# Altium project LUNA 2.PrjPcb
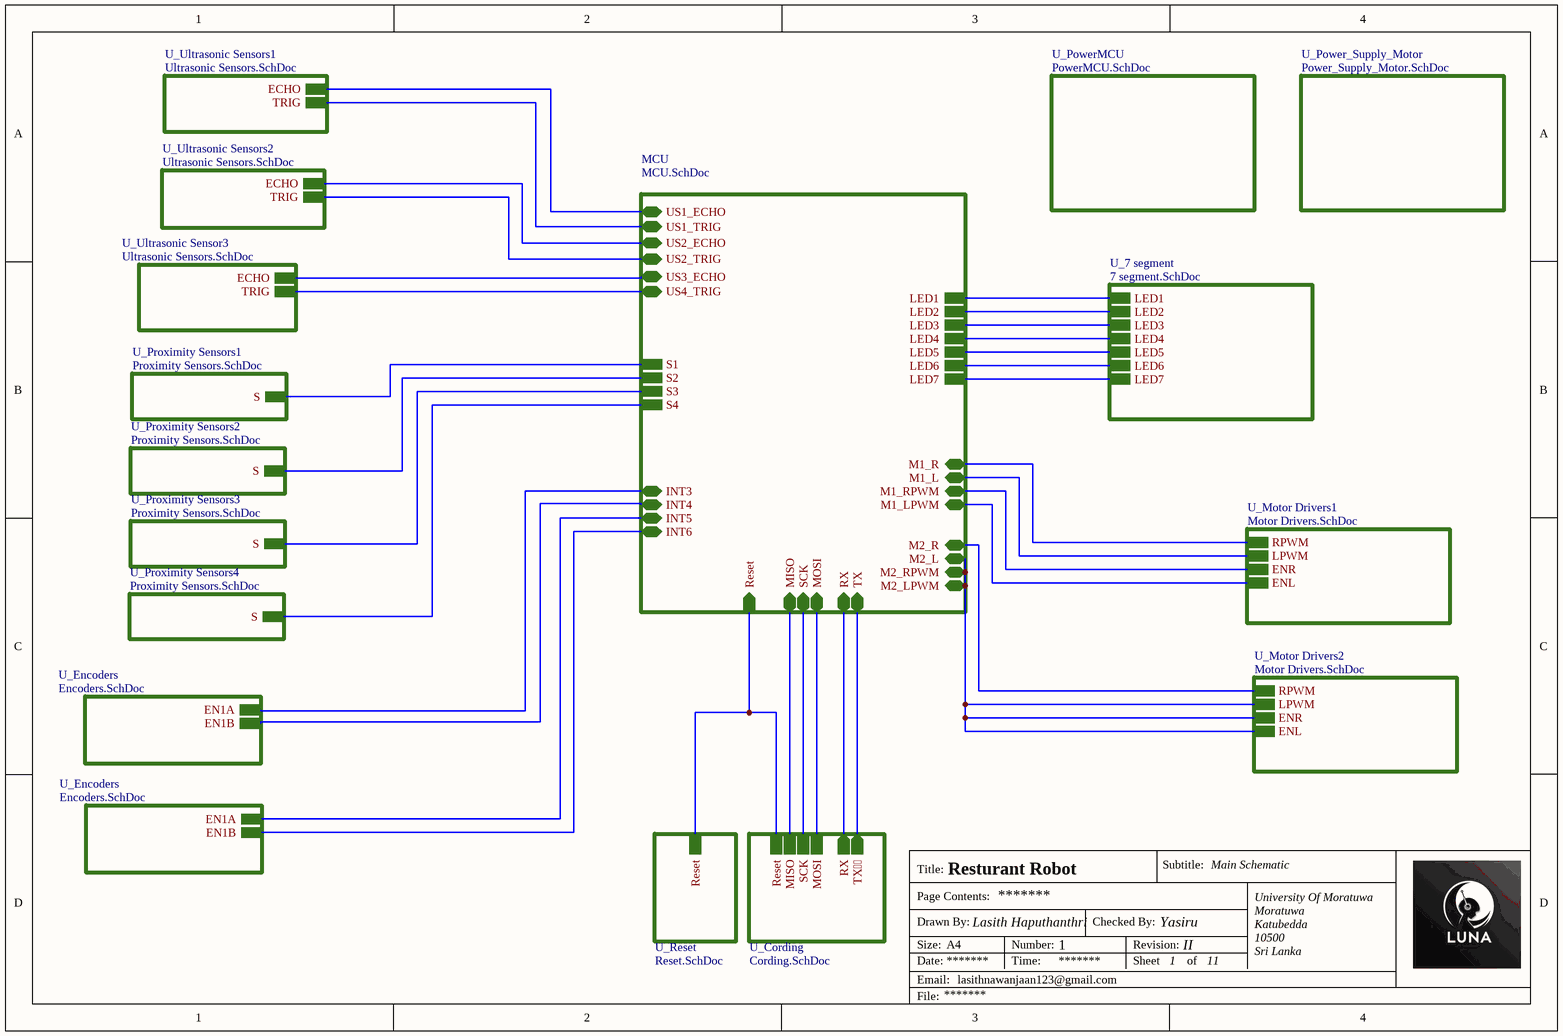
[diagram p0: Main_Schematic.SchDoc]
11 sheets, 71 parts. Net scope: hierarchical (ports join the sheet entries above them; power ports are global).
Board file: PCB.PcbDoc
Sheets:
  Main_Schematic.SchDoc
    MCU = MCU.SchDoc
    U_Reset = Reset.SchDoc
    U_Encoders = Encoders.SchDoc
    U_Motor Drivers1 = Motor Drivers.SchDoc
    U_Motor Drivers2 = Motor Drivers.SchDoc
    U_Encoders = Encoders.SchDoc
    U_Cording = Cording.SchDoc
    U_Ultrasonic Sensors1 = Ultrasonic Sensors.SchDoc
    U_Ultrasonic Sensors2 = Ultrasonic Sensors.SchDoc
    U_Ultrasonic Sensor3 = Ultrasonic Sensors.SchDoc
    U_PowerMCU = PowerMCU.SchDoc
    U_Power_Supply_Motor = Power_Supply_Motor.SchDoc
    U_7 segment = 7 segment.SchDoc
    U_Proximity Sensors1 = Proximity Sensors.SchDoc
    U_Proximity Sensors2 = Proximity Sensors.SchDoc
    U_Proximity Sensors3 = Proximity Sensors.SchDoc
    U_Proximity Sensors4 = Proximity Sensors.SchDoc

## Sheet Main_Schematic.SchDoc: Title
size A4; Date: *******; ApprovedBy: *******; CheckedBy: Yasiru; Author: *******; CompanyName: *******; DrawnBy: Lasith Haputhanthri; Engineer: *******; Organization: *******; Address1: *******; Address2: *******; Address3: *******; Address4: *******; DocumentNumber: 1; Revision: *******; SheetNumber: 1; SheetTotal: 11; Subtitle: Main Schematic; Project: Resturant Robot; VersionRevision: II; TotalSheet: 11; CurrentTime: *******; CurrentDate: *******; Time: *******; DocumentFullPathAndName: *******; DocumentName: *******; ModifiedDate: *******; ImagePath: *******; ProjectName: *******; Application_BuildNumber: *******

### Sub-sheets
MCU = MCU.SchDoc: Reset (in), INT3 (bidir), INT4 (bidir), INT5 (bidir), INT6 (bidir), M1_RPWM (bidir), M1_LPWM (bidir), M2_RPWM (bidir), M2_LPWM (bidir), M1_R (bidir), M1_L (bidir), M2_R (bidir), M2_L (bidir), TX (bidir), RX (bidir), SCK (bidir), MOSI (bidir), MISO (bidir), US1_ECHO (bidir), US1_TRIG (bidir), US2_ECHO (bidir), US2_TRIG (bidir), US3_ECHO (bidir), US4_TRIG (bidir), LED1, LED2, LED3, LED4, LED5, LED6, LED7, S1, S2, S3, S4
U_7 segment = 7 segment.SchDoc: LED1, LED2, LED3, LED4, LED5, LED6, LED7
U_Cording = Cording.SchDoc: MOSI, Reset, SCK, MISO, RX (out), TX (out)
U_Encoders = Encoders.SchDoc: EN1A, EN1B
U_Encoders = Encoders.SchDoc: EN1A, EN1B
U_Motor Drivers1 = Motor Drivers.SchDoc: RPWM, LPWM, ENR, ENL
U_Motor Drivers2 = Motor Drivers.SchDoc: RPWM, LPWM, ENR, ENL
U_Power_Supply_Motor = Power_Supply_Motor.SchDoc: no entries
U_PowerMCU = PowerMCU.SchDoc: no entries
U_Proximity Sensors1 = Proximity Sensors.SchDoc: S
U_Proximity Sensors2 = Proximity Sensors.SchDoc: S
U_Proximity Sensors3 = Proximity Sensors.SchDoc: S
U_Proximity Sensors4 = Proximity Sensors.SchDoc: S
U_Reset = Reset.SchDoc: Reset
U_Ultrasonic Sensor3 = Ultrasonic Sensors.SchDoc: ECHO, TRIG
U_Ultrasonic Sensors1 = Ultrasonic Sensors.SchDoc: ECHO, TRIG
U_Ultrasonic Sensors2 = Ultrasonic Sensors.SchDoc: ECHO, TRIG

### Nets
ECHO: sheet MCU/US1_ECHO, sheet U_Ultrasonic Sensors1/ECHO
ECHO: sheet MCU/US2_ECHO, sheet U_Ultrasonic Sensors2/ECHO  [a separate net that carries the same name]
ECHO: sheet MCU/US3_ECHO, sheet U_Ultrasonic Sensor3/ECHO  [a separate net that carries the same name]
EN1A: sheet MCU/INT3, sheet U_Encoders/EN1A
EN1A: sheet MCU/INT5, sheet U_Encoders/EN1A  [a separate net that carries the same name]
EN1B: sheet MCU/INT4, sheet U_Encoders/EN1B
EN1B: sheet MCU/INT6, sheet U_Encoders/EN1B  [a separate net that carries the same name]
ENL: sheet MCU/M2_RPWM, sheet MCU/M2_LPWM, sheet MCU/M2_L, sheet U_Motor Drivers2/LPWM, sheet U_Motor Drivers2/ENR, sheet U_Motor Drivers2/ENL
ENL: sheet MCU/M1_LPWM, sheet U_Motor Drivers1/ENL  [a separate net that carries the same name]
ENR: sheet MCU/M1_RPWM, sheet U_Motor Drivers1/ENR
LPWM: sheet MCU/M1_L, sheet U_Motor Drivers1/LPWM
Reset: sheet MCU/Reset, sheet U_Reset/Reset, sheet U_Cording/Reset
RPWM: sheet MCU/M2_R, sheet U_Motor Drivers2/RPWM
RPWM: sheet MCU/M1_R, sheet U_Motor Drivers1/RPWM  [a separate net that carries the same name]
TRIG: sheet MCU/US1_TRIG, sheet U_Ultrasonic Sensors1/TRIG
TRIG: sheet MCU/US2_TRIG, sheet U_Ultrasonic Sensors2/TRIG  [a separate net that carries the same name]
TRIG: sheet MCU/US4_TRIG, sheet U_Ultrasonic Sensor3/TRIG  [a separate net that carries the same name]
NetJ10_3: sheet MCU/SCK, sheet U_Cording/SCK
NetJ10_4: sheet MCU/MOSI, sheet U_Cording/MOSI
NetJ10_5: sheet MCU/MISO, sheet U_Cording/MISO
NetR1_1: sheet MCU/RX, sheet U_Cording/RX
NetR3_1: sheet MCU/TX, sheet U_Cording/TX
NetR11_1: sheet MCU/LED1, sheet U_7 segment/LED1
NetR12_1: sheet MCU/LED2, sheet U_7 segment/LED2
NetR13_1: sheet MCU/LED3, sheet U_7 segment/LED3
NetR14_1: sheet MCU/LED4, sheet U_7 segment/LED4
NetR15_1: sheet MCU/LED5, sheet U_7 segment/LED5
NetR16_1: sheet MCU/LED6, sheet U_7 segment/LED6
NetR17_1: sheet MCU/LED7, sheet U_7 segment/LED7
NetR19_U_Proximity_Sensors1_1: sheet MCU/S1, sheet U_Proximity Sensors1/S
NetR19_U_Proximity_Sensors2_1: sheet MCU/S2, sheet U_Proximity Sensors2/S
NetR19_U_Proximity_Sensors3_1: sheet MCU/S3, sheet U_Proximity Sensors3/S
NetR19_U_Proximity_Sensors4_1: sheet MCU/S4, sheet U_Proximity Sensors4/S

### Notes on the sheet
- Title:
- Drawn By:
- Page Contents:
- Checked By:
- Subtitle:
- University Of Moratuwa
- Moratuwa
- Size:
- Date:
- File:
- Email:
- A4
- lasithnawanjaan123@gmail.com
- Lasith Haputhanthri
- Number:
- Time:
- Revision:
- Sheet
- of
- Katubedda
- 10500
- Sri Lanka

## Sheet MCU.SchDoc: Title
size A4; Date: *******; ApprovedBy: *******; CheckedBy: Yasiru; Author: *******; CompanyName: *******; DrawnBy: Name; Engineer: *******; Organization: *******; Address1: *******; Address2: *******; Address3: *******; Address4: *******; DocumentNumber: Doc Num; Revision: *******; SheetNumber: 9; SheetTotal: 11; Subtitle: MCU; Project: Resturant Robot; VersionRevision: III; TotalSheet: 11; CurrentTime: *******; CurrentDate: *******; Time: *******; DocumentFullPathAndName: *******; DocumentName: *******; ModifiedDate: *******; ImagePath: *******; ProjectName: *******; Application_BuildNumber: *******
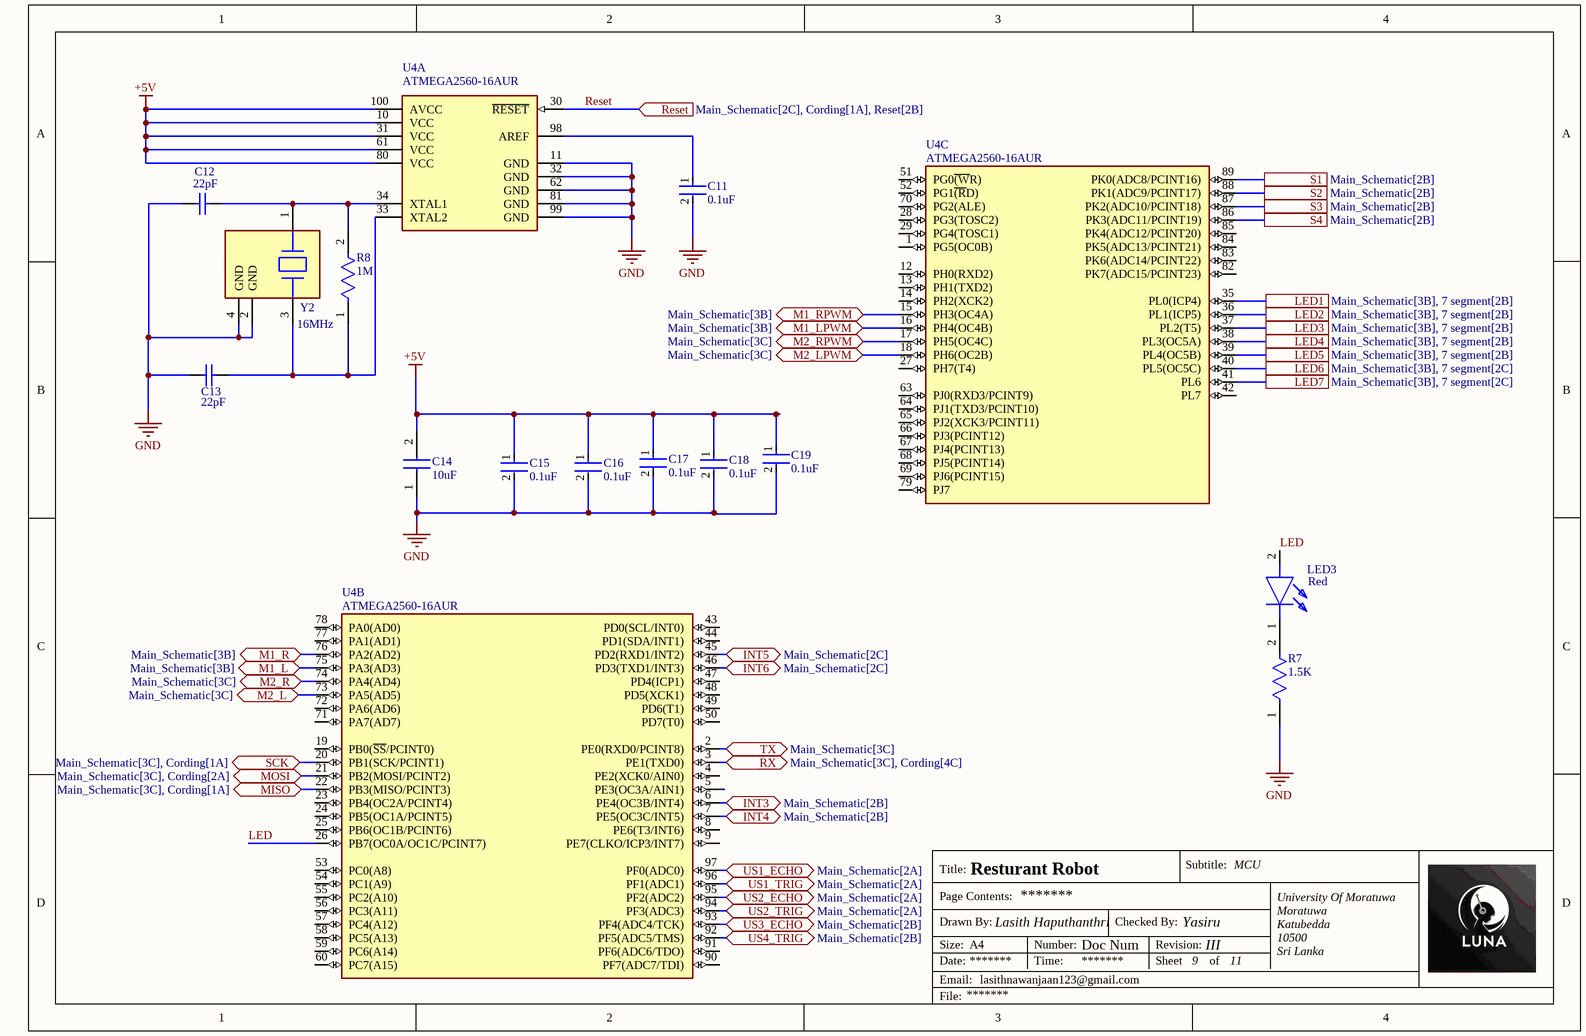
[diagram p1: MCU.SchDoc]

### Parts
C11  0.1uF  [FP-CC0603-DA-MFG]
C12  22pF  [CAPC1608X90X40LL10T20]
C13  22pF  [CAPC1608X90X40LL10T20]
C14  10uF  [CAPC1608X90N]
C15  0.1uF  [FP-CC0603-DA-MFG]
C16  0.1uF  [FP-CC0603-DA-MFG]
C17  0.1uF  [FP-CC0603-DA-MFG]
C18  0.1uF  [FP-CC0603-DA-MFG]
C19  0.1uF  [FP-CC0603-DA-MFG]
LED3  Red  [LEDC1608X55N]
R7  1.5K  [FP-AF0603-IPC_B]
R8  1M  [FP-AF0603-IPC_B]
U4  ATMEGA2560-16AUR  [FP-100A-MFG]  (parts A,B,C of 3)
Y2  16MHz  [FP-ABM8G-MFG]

### Ports
INT3 (bidir, see Main_Schematic[2B]), INT4 (bidir, see Main_Schematic[2B]), INT5 (bidir, see Main_Schematic[2C]), INT6 (bidir, see Main_Schematic[2C]), LED1 (see Main_Schematic[3B], 7 segment[2B]), LED2 (see Main_Schematic[3B], 7 segment[2B]), LED3 (see Main_Schematic[3B], 7 segment[2B]), LED4 (see Main_Schematic[3B], 7 segment[2B]), LED5 (see Main_Schematic[3B], 7 segment[2B]), LED6 (see Main_Schematic[3B], 7 segment[2C]), LED7 (see Main_Schematic[3B], 7 segment[2C]), M1_L (bidir, see Main_Schematic[3B]), M1_LPWM (bidir, see Main_Schematic[3B]), M1_R (bidir, see Main_Schematic[3B]), M1_RPWM (bidir, see Main_Schematic[3B]), M2_L (bidir, see Main_Schematic[3C]), M2_LPWM (bidir, see Main_Schematic[3C]), M2_R (bidir, see Main_Schematic[3C]), M2_RPWM (bidir, see Main_Schematic[3C]), MISO (bidir, see Main_Schematic[3C], Cording[1A]), MOSI (bidir, see Main_Schematic[3C], Cording[2A]), Reset (in, see Main_Schematic[2C], Cording[1A], Reset[2B]), RX (bidir, see Main_Schematic[3C], Cording[4C]), S1 (see Main_Schematic[2B]), S2 (see Main_Schematic[2B]), S3 (see Main_Schematic[2B]), S4 (see Main_Schematic[2B]), SCK (bidir, see Main_Schematic[3C], Cording[1A]), TX (bidir, see Main_Schematic[3C]), US1_ECHO (bidir, see Main_Schematic[2A]), US1_TRIG (bidir, see Main_Schematic[2A]), US2_ECHO (bidir, see Main_Schematic[2A]), US2_TRIG (bidir, see Main_Schematic[2A]), US3_ECHO (bidir, see Main_Schematic[2B]), US4_TRIG (bidir, see Main_Schematic[2B])

### Nets
+5V: C14.2 C15.1 C16.1 C17.1 C18.1 C19.1 U4.10(VCC) U4.31(VCC) U4.61(VCC) U4.80(VCC) U4.100(AVCC)
GND: C11.2 C12.1 C13.1 C14.1 C15.2 C16.2 C17.2 C18.2 C19.2 R7.1 U4.11(GND) U4.32(GND) U4.62(GND) U4.81(GND) U4.99(GND) Y2.2(GND) Y2.4(GND)
ECHO: U4.97(PF0(ADC0)) ; port US1_ECHO
ECHO: U4.95(PF2(ADC2)) ; port US2_ECHO  [a separate net that carries the same name]
ECHO: U4.93(PF4(ADC4/TCK)) ; port US3_ECHO  [a separate net that carries the same name]
EN1A: U4.6(PE4(OC3B/INT4)) ; port INT3
EN1A: U4.45(PD2(RXD1/INT2)) ; port INT5  [a separate net that carries the same name]
EN1B: U4.7(PE5(OC3C/INT5)) ; port INT4
EN1B: U4.46(PD3(TXD1/INT3)) ; port INT6  [a separate net that carries the same name]
ENL: U4.17(PH5(OC4C)) U4.18(PH6(OC2B)) U4.73(PA5(AD5)) ; port M2_RPWM, port M2_LPWM, port M2_L
ENL: U4.16(PH4(OC4B)) ; port M1_LPWM  [a separate net that carries the same name]
ENR: U4.15(PH3(OC4A)) ; port M1_RPWM
LED: LED3.2(A) U4.26(PB7(OC0A/OC1C/PCINT7))
LPWM: U4.75(PA3(AD3)) ; port M1_L
Reset: U4.30(~{RESET}) ; port Reset
RPWM: U4.74(PA4(AD4)) ; port M2_R
RPWM: U4.76(PA2(AD2)) ; port M1_R  [a separate net that carries the same name]
TRIG: U4.96(PF1(ADC1)) ; port US1_TRIG
TRIG: U4.94(PF3(ADC3)) ; port US2_TRIG  [a separate net that carries the same name]
TRIG: U4.92(PF5(ADC5/TMS)) ; port US4_TRIG  [a separate net that carries the same name]
NetC11_1: C11.1 U4.98(AREF)
NetC12_2: C12.2 R8.2 U4.34(XTAL1) Y2.1
NetC13_2: C13.2 R8.1 U4.33(XTAL2) Y2.3
NetJ10_3: U4.20(PB1(SCK/PCINT1)) ; port SCK
NetJ10_4: U4.21(PB2(MOSI/PCINT2)) ; port MOSI
NetJ10_5: U4.22(PB3(MISO/PCINT3)) ; port MISO
NetLED3_1: LED3.1(K) R7.2
NetR1_1: U4.3(PE1(TXD0)) ; port RX
NetR3_1: U4.2(PE0(RXD0/PCINT8)) ; port TX
NetR11_1: U4.35(PL0(ICP4)) ; port LED1
NetR12_1: U4.36(PL1(ICP5)) ; port LED2
NetR13_1: U4.37(PL2(T5)) ; port LED3
NetR14_1: U4.38(PL3(OC5A)) ; port LED4
NetR15_1: U4.39(PL4(OC5B)) ; port LED5
NetR16_1: U4.40(PL5(OC5C)) ; port LED6
NetR17_1: U4.41(PL6) ; port LED7
NetR19_U_Proximity_Sensors1_1: U4.89(PK0(ADC8/PCINT16)) ; port S1
NetR19_U_Proximity_Sensors2_1: U4.88(PK1(ADC9/PCINT17)) ; port S2
NetR19_U_Proximity_Sensors3_1: U4.87(PK2(ADC10/PCINT18)) ; port S3
NetR19_U_Proximity_Sensors4_1: U4.86(PK3(ADC11/PCINT19)) ; port S4

Not connected (* = marked no-connect by the designer): U4 1(PG5(OC0B)) 4(PE2(XCK0/AIN0)) 5(PE3(OC3A/AIN1)) 8(PE6(T3/INT6)) 9(PE7(CLKO/ICP3/INT7)) 12(PH0(RXD2)) 13(PH1(TXD2)) 14(PH2(XCK2)) 19(PB0(~{SS}/PCINT0)) 23(PB4(OC2A/PCINT4)) 24(PB5(OC1A/PCINT5)) 25(PB6(OC1B/PCINT6)) 27(PH7(T4)) 28(PG3(TOSC2)) 29(PG4(TOSC1)) 42(PL7) 43(PD0(SCL/INT0)) 44(PD1(SDA/INT1)) 47(PD4(ICP1)) 48(PD5(XCK1)) 49(PD6(T1)) 50(PD7(T0)) 51(PG0~{(W}R)) 52(PG1~{(R}D)) 53(PC0(A8)) 54(PC1(A9)) 55(PC2(A10)) 56(PC3(A11)) 57(PC4(A12)) 58(PC5(A13)) 59(PC6(A14)) 60(PC7(A15)) 63(PJ0(RXD3/PCINT9)) 64(PJ1(TXD3/PCINT10)) 65(PJ2(XCK3/PCINT11)) 66(PJ3(PCINT12)) 67(PJ4(PCINT13)) 68(PJ5(PCINT14)) 69(PJ6(PCINT15)) 70(PG2(ALE)) 71(PA7(AD7)) 72(PA6(AD6)) 77(PA1(AD1)) 78(PA0(AD0)) 79(PJ7) 82(PK7(ADC15/PCINT23)) 83(PK6(ADC14/PCINT22)) 84(PK5(ADC13/PCINT21)) 85(PK4(ADC12/PCINT20)) 90(PF7(ADC7/TDI)) 91(PF6(ADC6/TDO))

### Notes on the sheet
- Title:
- Drawn By:
- Page Contents:
- Checked By:
- Subtitle:
- University Of Moratuwa
- Moratuwa
- Size:
- Date:
- File:
- Email:
- A4
- lasithnawanjaan123@gmail.com
- Lasith Haputhanthri
- Number:
- Time:
- Revision:
- Sheet
- of
- Katubedda
- 10500
- Sri Lanka

### Library data of the parts
C11 C15-C19 = CMP-2100-03601-2: CC0603KRX7R9BB104 CAP CER 0.1UF 50V X7R 0603; Manufacturer: YAGEO; Material: Ceramic; Capacitance: 100 nF; Temperature Coefficient: 15%; Tolerance: 0.1; Value: 100 nF; Height: 0.9mm; Voltage: 50 V; ComponentLink2Description: Datasheet; Device Class L2: Capacitors; Temperature Range High: +125°C; Category: Cap; Footprint Url: http://www.yageo.com/exep/pages/download/literatures/UPY-C_GEN_24.pdf; ComponentLink2URL: http://www.yageo.com/documents/recent/UPY-GPHC_X7R_6.3V-to-50V_18.pdf; Package: CC0603-DA; Temperature: -55°C to +125°C; Voltage Rating: 50 V; Temperature Characteristic: X7R; Device Class L1: Passive Components; Temperature Range Low: -55°C; Manufacturer Part Number: CC0603KRX7R9BB104; RoHS: TRUE; Automotive: No; Device Class L3: Ceramic Capacitors; Octopart: https://octopart.com/cc0603krx7r9bb104-yageo-42244635; Mouser Description: Multilayer Ceramic Capacitor, CC Series, 0.1 - F, - 10%, X7R, 50 V, 0603 [1608 Metric]; Lead Free: Yes; Digikey Description: CAP CER 0.1UF 50V X7R 0603
C12 C13 = CMP-1659-00026-1: CC0603JRNPO9BN220 Chip Capacitor, 22 pF, +/- 5%, 50 V, -55 to 125 degC, 0603 (1608 Metric), RoHS, Tape and Reel; ComponentLink1URL: http://www.yageo.com/; PackageReference: 0603; ComponentLink1Description: Manufacturer URL; PackageDescription: 2-Pin Surface Mount Device, Body 1.6 x 0.8 mm; DatasheetVersion: Rev. 8, 08/2011; ComponentLink2Description: Datasheet; ComponentLink2URL: http://www.yageo.com/documents/recent/UPY-GP_NP0_16V-to-50V_8.pdf
C14 = CL10A106KP8NNNC: CL10A106KP8NNNC Capacitor; Manufacturer_Name: SAMSUNG; Datasheet Link: https://datasheet.datasheetarchive.com/originals/distributors/Datasheets-DGA10/2415998.pdf; Height: 0.9mm; Manufacturer_Part_Number: CL10A106KP8NNNC; Mouser Part Number: 187-CL10A106KP8NNNC; Mouser Price/Stock: https://www.mouser.co.uk/ProductDetail/Samsung-Electro-Mechanics/CL10A106KP8NNNC?qs=X6jEic%2FHinAlyfRHj7fKwg%3D%3D; Arrow Part Number: CL10A106KP8NNNC; Arrow Price/Stock: https://www.arrow.com/en/products/cl10a106kp8nnnc/samsung-electro-mechanics?region=europe
LED3 = LTST-C191KRKT: LED; Manufacturer_Name: Lite-On; Datasheet Link: http://www.mouser.com/ds/2/239/S_110_LTST-C191KRKT-539838.pdf; Height: 0.55mm; Manufacturer_Part_Number: LTST-C191KRKT; Mouser Part Number: 859-LTST-C191KRKT; Mouser Price/Stock: https://www.mouser.co.uk/ProductDetail/Lite-On/LTST-C191KRKT?qs=BAIUz4Y8PJBLfOhzue0q%252BA%3D%3D; Arrow Part Number: LTST-C191KRKT; Arrow Price/Stock: https://www.arrow.com/en/products/ltst-c191krkt/lite-on-technology?region=nac
R7 R8 = CMP-03412-043191-1: AF0603FR-071K5L Anti-Sulfurated Chip Resistors Automotive Grade 1.5kΩ 1% 100ppm/°C 0603; Resistance: 1.5kR; Max Power Dissipation: 100mW; Length: 0.063inch; Packaging: Tape and Reel; Tolerance: 1%; RoHS Compliant: Yes; Series: AF; Temperature Coefficient: 100ppm/°C; Case/Package: 0603; Height: 0.022inch; Min Operating Temperature: -55°C; Resistor Type: Thick Film; Features: Moisture Resistant; Width: 0.031inch; Number of Terminations: 2; Max Operating Temperature: 155°C
U4 = CMP-06276-000073-1: IC MCU 8BIT 256KB FLASH 100TQFP; Oscillator Type: External; Interface: UART; Memory Type: OTP; Memory Size: 8KB; Core Architecture: PIC; Peripherals: POR; Frequency: 16MHz; Number of I/Os: 33; Packaging: Rail/Tube; Max Operating Temperature: 70°C; Case/Package: DIP; Min Operating Temperature: 0°C
Y2 = CMP-2000-05039-3: ABM8G-16.000MHZ-18-D2Y-T Crystal 16MHz ±20ppm (Tol) ±30ppm (Stability) 18pF FUND 120Ω 4-Pin SMD T/R; Series Resistance: 120R; Operating Frequency: 12 MHz; Frequency: 12MHz; Max Operating Temperature: 85°C; Mount: Surface Mount; Width: 2.5mm; Series: ABM8G; Termination: SMD/SMT; Frequency Tolerance: 20ppm; Tolerance: 20ppm; Min Operating Temperature: -40°C; Depth: 2.5mm; Load Capacitance: 18pF; Number of Pins: 4; Length: 3.2mm; Radiation Hardening: No; Frequency Stability: 30ppm; Height: 1mm; Packaging: Tape and Reel; Package Quantity: 1000; ESR (Equivalent Series Resistance): 120R; Lead Free: Lead Free; Case/Package: CSMD

## Sheet Reset.SchDoc: Title
size A4; Date: *******; ApprovedBy: *******; CheckedBy: Yasiru; Author: *******; CompanyName: *******; DrawnBy: Name; Engineer: *******; Organization: *******; Address1: *******; Address2: *******; Address3: *******; Address4: *******; DocumentNumber: Doc Num; Revision: *******; SheetNumber: 8; SheetTotal: 11; Subtitle: MCU Reset; Project: Resturant Robot; VersionRevision: III; TotalSheet: 11; CurrentTime: *******; CurrentDate: *******; Time: *******; DocumentFullPathAndName: *******; DocumentName: *******; ModifiedDate: *******; ImagePath: *******; ProjectName: *******; Application_BuildNumber: *******
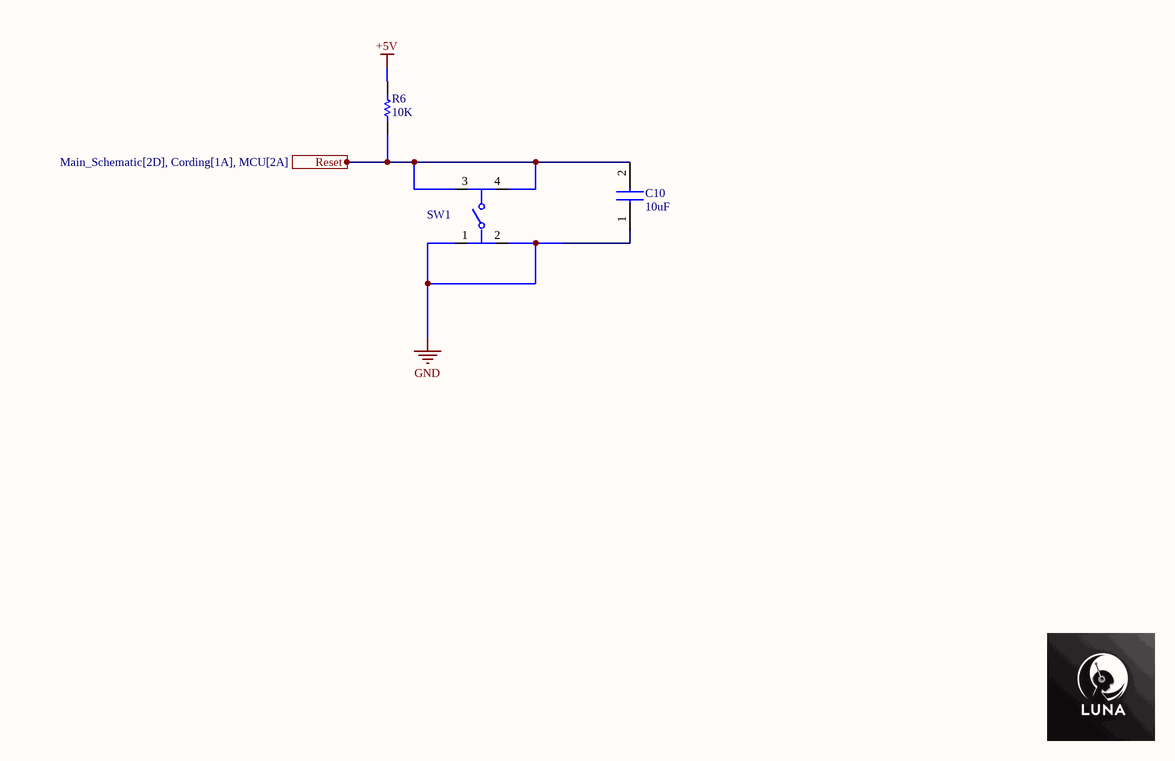
[diagram p2: Reset.SchDoc]

### Parts
C10  10uF  [CAPC1608X90N]
R6  10K  [RESC1608X55X25ML10T15]
SW1  PTS526SK15SMTR2LFS  [FP-PTS526SK15SMTR2LFS-MFG]  (value not drawn)

### Ports
Reset (see Main_Schematic[2D], Cording[1A], MCU[2A])

### Nets
+5V: R6.2
GND: C10.1 SW1.1 SW1.2
Reset: C10.2 R6.1 SW1.3 SW1.4 ; port Reset

### Notes on the sheet
- Title:
- Drawn By:
- Page Contents:
- Checked By:
- Subtitle:
- University Of Moratuwa
- Moratuwa
- Size:
- Date:
- File:
- Email:
- A4
- lasithnawanjaan123@gmail.com
- Lasith Haputhanthri
- Number:
- Time:
- Revision:
- Sheet
- of
- Katubedda
- 10500
- Sri Lanka

### Library data of the parts
C10 = CL10A106KP8NNNC: as C14 on sheet MCU; Datasheet Link: https://datasheet.datasheetarchive.com/originals/distributors/Datasheets-DGA10/2415998.pdf; Height: 0.9mm; Manufacturer_Part_Number: CL10A106KP8NNNC; Mouser Part Number: 187-CL10A106KP8NNNC; Mouser Price/Stock: https://www.mouser.co.uk/ProductDetail/Samsung-Electro-Mechanics/CL10A106KP8NNNC?qs=X6jEic%2FHinAlyfRHj7fKwg%3D%3D; Arrow Part Number: CL10A106KP8NNNC; Arrow Price/Stock: https://www.arrow.com/en/products/cl10a106kp8nnnc/samsung-electro-mechanics?region=europe
R6 = CMP-2000-05022-1: RC0603JR-0710KL Resistor, 10 KOhm, +/- 5%, 100 mW, -55 to 155 degC, 0603 (1608 Metric), RoHS, Tape and Reel; Manufacturer: Yageo; Resistance: 10kOhms; Voltage Rating: 50V; Temperature Coefficient: 100PPM/C; Power Rating: 100mW; Package Reference: 603; Series: RC; Case Code - mm: 1608; Packaging: Reel; Datasheet URL: http://www.farnell.com/datasheets/443971.pdf; Datasheet Version: Rev. 4, 04/2009; Operating Temperature Range: -55Cto+155C; Product: ThickFilmResistorsGeneralPurpose; Package Description: 2-Pin Surface Mount Device, Body 1.6 x 0.8 mm; Manufacturer URL: http://www.yageo.com/; Case Code - in: 0603; Tolerance: 5%; Termination Style: SMD/SMT
SW1 = CMP-10040-000013-1: TACT 5.2 X 5.2, 1.5 MM H, 260GF,; Manufacturer: C&K; Operating Force: 250gf; Throw Configuration: SPST-NO; Contact Current Rating: 50mA; Standoff Height: 0mm; Contact Resistance: 100mΩ; Voltage Rating Dc: 12V; Electromechanical Life: 200000Cycles; Device Class L3: Tactile Switches; Device Class L2: Switches; Temperature: -20°C to +70°C; Temperature Range Low: -20°C; Package: PTS526SK15SMTR2LFS; Temperature Range High: +70°C; ComponentLink2Description: Datasheet; Device Class L1: Electromechanical; Height: 1.65mm; Digikey Description: TACT 5.2 X 5.2, 1.5 MM H, 260GF,; Category: Switch; RoHS: TRUE; Automotive: No; Lead Free: Yes; Manufacturer Part Number: PTS526SK15SMTR2LFS; Octopart: https://octopart.com/pts526+sk15+smtr2+lfs-c%26k+components-100617999; ComponentLink2URL: https://www.ckswitches.com/media/2780/pts526.pdf

## Sheet Encoders.SchDoc: Title
size A4; Date: *******; ApprovedBy: *******; CheckedBy: Yasiru; Author: *******; CompanyName: *******; DrawnBy: Name; Engineer: *******; Organization: *******; Address1: *******; Address2: *******; Address3: *******; Address4: *******; DocumentNumber: Doc Num; Revision: *******; SheetNumber: 3; SheetTotal: 11; Subtitle: Encoder JST; Project: Resturant Robot; VersionRevision: III; TotalSheet: 11; CurrentTime: *******; CurrentDate: *******; Time: *******; DocumentFullPathAndName: *******; DocumentName: *******; ModifiedDate: *******; ImagePath: *******; ProjectName: *******; Application_BuildNumber: *******
Used 2 times, as channels U_Encoders, U_Encoders. Parts and nets are listed once, with the designators drawn on the sheet.
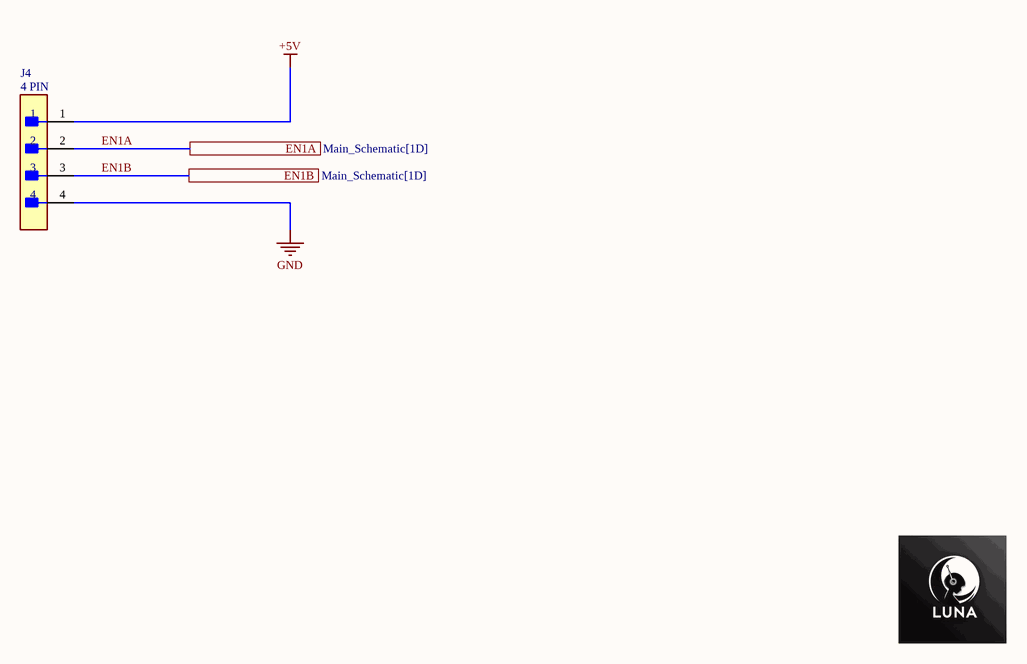
[diagram p3: Encoders.SchDoc]

### Parts
J4  4 PIN  [FP-B4B-XH-A_LF_SN-MFG]

### Ports
EN1A (see Main_Schematic[1D]), EN1B (see Main_Schematic[1D])

### Nets
+5V: J4.1
GND: J4.4
EN1A: J4.2 ; port EN1A
EN1B: J4.3 ; port EN1B

### Channels
U_Encoders: designators end in _U_Encoders#1; ports EN1A=EN1A EN1B=EN1B
U_Encoders: designators end in _U_Encoders#2; ports EN1A=EN1A EN1B=EN1B

### Notes on the sheet
- Title:
- Drawn By:
- Page Contents:
- Checked By:
- Subtitle:
- University Of Moratuwa
- Moratuwa
- Size:
- Date:
- File:
- Email:
- A4
- lasithnawanjaan123@gmail.com
- Lasith Haputhanthri
- Number:
- Time:
- Revision:
- Sheet
- of
- Katubedda
- 10500
- Sri Lanka

### Library data of the parts
J4 = CMP-17439-000250-1: CONN HEADER VERT 4POS 2.5MM; Number of Contacts: 4; Contact Resistance: 20mR; Voltage Rating: 250V; Max Current Rating: 3A; Gender: Male; Wire/Cable Gauge: 22AWG; Mated Stacking Heights: 9.8mm; Insulation Resistance: 1GR; Orientation: Straight; Contact Type: Male Pin; Contact Finish - Mating: TIN; Series: XH; Max Voltage Rating (AC): 250V; Lead Pitch: 2.5mm; Contact Shape: Square; Insulation Color: Natural; Termination: Solder; Lead Free: Lead Free; Voltage Rating (AC): 250V; Number of Rows: 1; Flammability Rating: UL94 V-0; Number of Positions: 4; Max Operating Temperature: 85°C; Package Quantity: 500; Mount: Through Hole; REACH SVHC: No SVHC; Connector Type: Header; Insulation Material: Nylon; Fastening Type: Detent; Min Operating Temperature: -25°C; Housing Color: White; Packaging: Bulk; Contact Plating: Tin; Contact Material: Brass; Max Voltage Rating (DC): 250V; Housing Material: Polyamide; Color: Natural; Material: Polyamide; Pitch: 2.5mm; Depth: 5.75mm; Current Rating: 3A; Length: 12.4mm

## Sheet Motor Drivers.SchDoc: Title
size A4; Date: *******; ApprovedBy: *******; CheckedBy: Yasiru; Author: *******; CompanyName: *******; DrawnBy: Name; Engineer: *******; Organization: *******; Address1: *******; Address2: *******; Address3: *******; Address4: *******; DocumentNumber: Doc Num; Revision: *******; SheetNumber: 4; SheetTotal: 11; Subtitle: Motor Drivers JST; Project: Resturant Robot; VersionRevision: III; TotalSheet: 11; CurrentTime: *******; CurrentDate: *******; Time: *******; DocumentFullPathAndName: *******; DocumentName: *******; ModifiedDate: *******; ImagePath: *******; ProjectName: *******; Application_BuildNumber: *******
Used 2 times, as channels U_Motor Drivers1, U_Motor Drivers2. Parts and nets are listed once, with the designators drawn on the sheet.
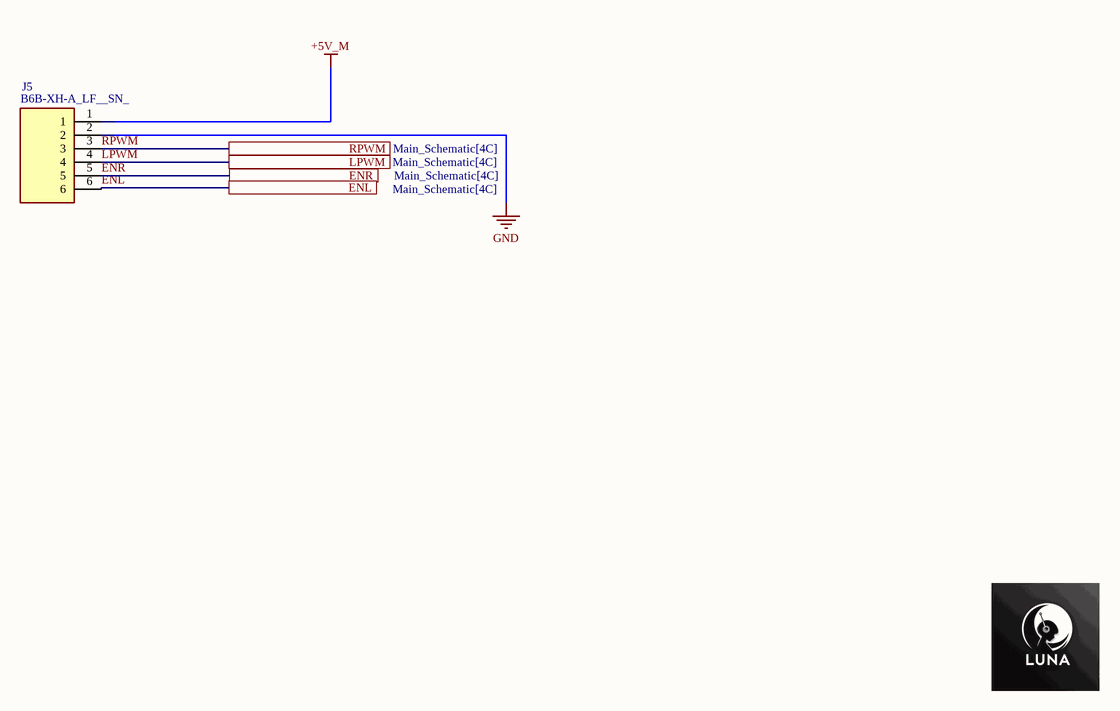
[diagram p4: Motor Drivers.SchDoc]

### Parts
J5  B6B-XH-A_LF__SN_  [SHDR6W64P0X250_1X6_1740X575X700P]

### Ports
ENL (see Main_Schematic[4C]), ENR (see Main_Schematic[4C]), LPWM (see Main_Schematic[4C]), RPWM (see Main_Schematic[4C])

### Nets
+5V_M: J5.1
GND: J5.2
ENL: J5.6 ; port ENL
ENR: J5.5 ; port ENR
LPWM: J5.4 ; port LPWM
RPWM: J5.3 ; port RPWM

### Channels
U_Motor Drivers1: designators end in _U_Motor_Drivers1; ports ENL=ENL ENR=ENR LPWM=LPWM RPWM=RPWM
U_Motor Drivers2: designators end in _U_Motor_Drivers2; ports ENL=ENL ENR=ENL LPWM=ENL RPWM=RPWM

### Notes on the sheet
- Title:
- Drawn By:
- Page Contents:
- Checked By:
- Subtitle:
- University Of Moratuwa
- Moratuwa
- Size:
- Date:
- File:
- Email:
- A4
- lasithnawanjaan123@gmail.com
- Lasith Haputhanthri
- Number:
- Time:
- Revision:
- Sheet
- of
- Katubedda
- 10500
- Sri Lanka

### Library data of the parts
J5 = B6B-XH-A_LF__SN_: Connector; Manufacturer_Name: JST (JAPAN SOLDERLESS TERMINALS); Manufacturer_Part_Number: B6B-XH-A(LF)(SN); Datasheet Link: https://datasheet.lcsc.com/szlcsc/JST-Sales-America-B6B-XH-A-LF-SN_C144397.pdf; Height: 7mm; Arrow Part Number: B6B-XH-A(LF)(SN); Arrow Price/Stock: https://www.arrow.com/en/products/b6b-xh-a-lf-sn/jst-manufacturing?region=europe

## Sheet Cording.SchDoc: Title
size A4; Date: *******; ApprovedBy: *******; CheckedBy: Yasiru; Author: *******; CompanyName: *******; DrawnBy: Name; Engineer: *******; Organization: *******; Address1: *******; Address2: *******; Address3: *******; Address4: *******; DocumentNumber: Doc Num; Revision: *******; SheetNumber: 2; SheetTotal: 11; Subtitle: UART Interface; Project: Resturant Robot; VersionRevision: III; TotalSheet: 11; CurrentTime: *******; CurrentDate: *******; Time: *******; DocumentFullPathAndName: *******; DocumentName: *******; ModifiedDate: *******; ImagePath: *******; ProjectName: *******; Application_BuildNumber: *******
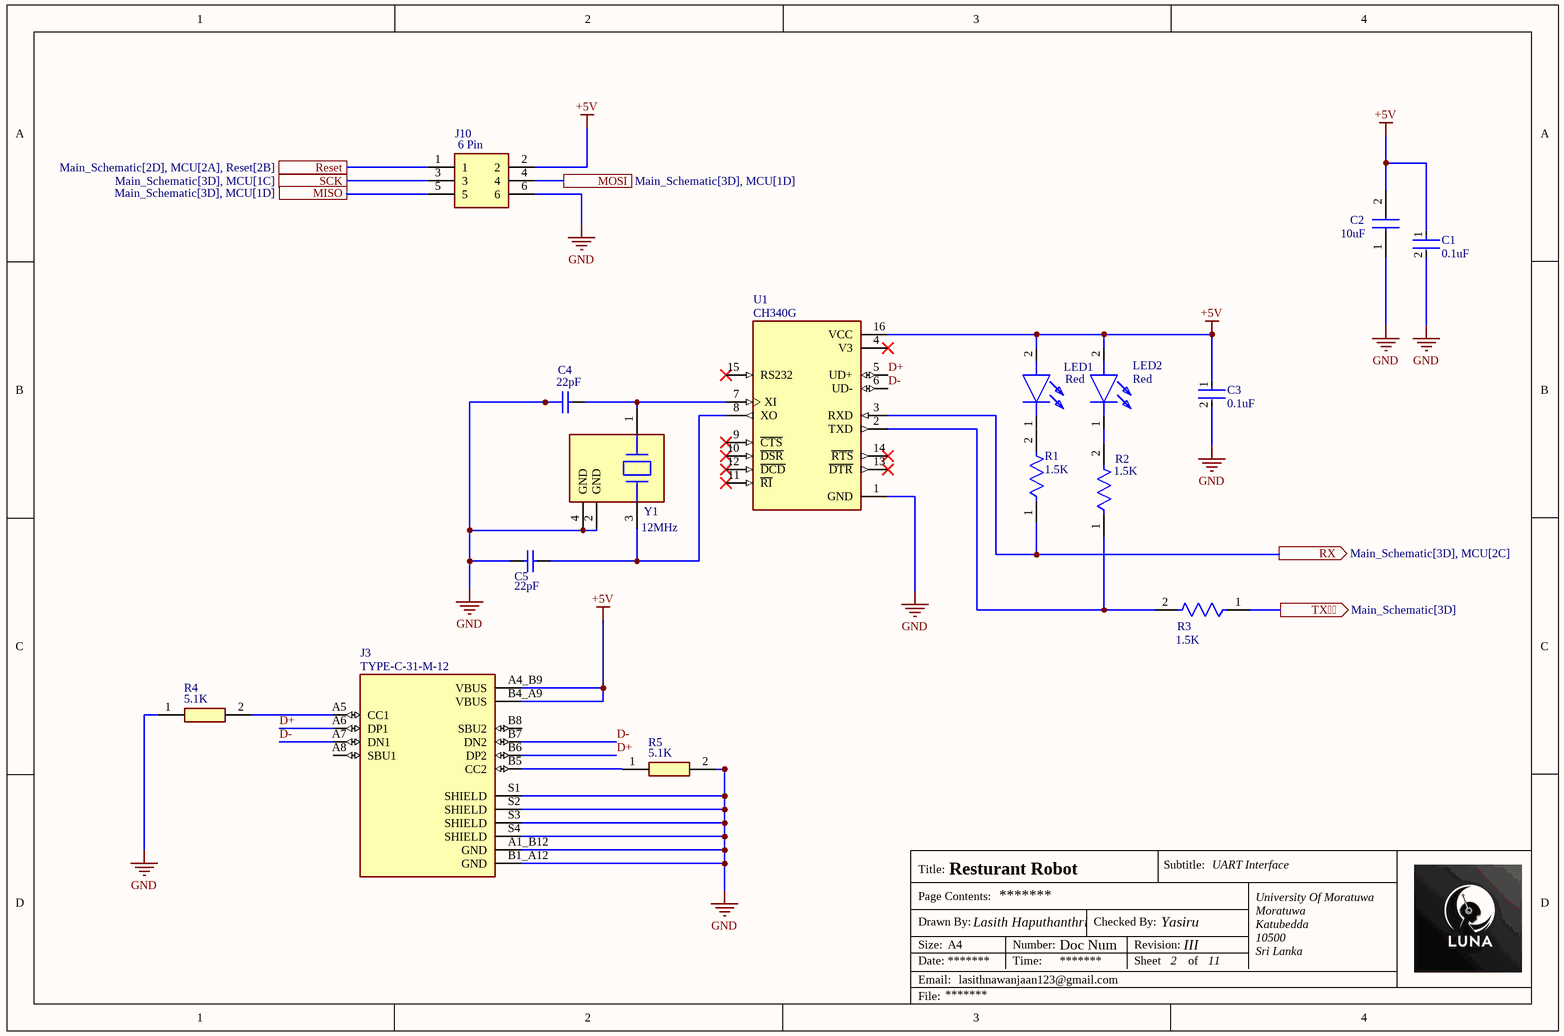
[diagram p5: Cording.SchDoc]

### Parts
C1  0.1uF  [FP-CC0603-DA-MFG]
C2  10uF  [CAPC1608X90N]
C3  0.1uF  [FP-CC0603-DA-MFG]
C4  22pF  [CAPC1608X90X40LL10T20]
C5  22pF  [CAPC1608X90X40LL10T20]
J3  TYPE-C-31-M-12  [HRO_TYPE-C-31-M-12]
J10  6 Pin  [HDRV6W64P254_2X3_762X508X868P]
LED1  Red  [LEDC1608X55N]
LED2  Red  [LEDC1608X55N]
R1  1.5K  [FP-AF0603-IPC_B]
R2  1.5K  [FP-AF0603-IPC_B]
R3  1.5K  [FP-AF0603-IPC_B]
R4  5.1K  [RESC1608X55N]
R5  5.1K  [RESC1608X55N]
U1  CH340G  [SOIC127P600X180-16N]
Y1  12MHz  [FP-ABM8G-MFG]

### Ports
MISO (see Main_Schematic[3D], MCU[1D]), MOSI (see Main_Schematic[3D], MCU[1D]), Reset (see Main_Schematic[2D], MCU[2A], Reset[2B]), RX (out, see Main_Schematic[3D], MCU[2C]), SCK (see Main_Schematic[3D], MCU[1C]), TX (out, see Main_Schematic[3D])

### Nets
+5V: C1.1 C2.2 C3.1 J3.A4_B9(VBUS) J3.B4_A9(VBUS) J10.2 LED1.2(A) LED2.2(A) U1.16(VCC)
GND: C1.2 C2.1 C3.2 C4.1 C5.1 J3.A1_B12(GND) J3.B1_A12(GND) J3.S1(SHIELD) J3.S2(SHIELD) J3.S3(SHIELD) J3.S4(SHIELD) J10.6 R4.1 R5.2 U1.1(GND) Y1.2(GND) Y1.4(GND)
D+: J3.A6(DP1) J3.B6(DP2) U1.5(UD+)
D-: J3.A7(DN1) J3.B7(DN2) U1.6(UD-)
Reset: J10.1 ; port Reset
NetC4_2: C4.2 U1.7(XI) Y1.1
NetC5_2: C5.2 U1.8(XO) Y1.3
NetJ3_A5: J3.A5(CC1) R4.2
NetJ3_B5: J3.B5(CC2) R5.1
NetJ10_3: J10.3 ; port SCK
NetJ10_4: J10.4 ; port MOSI
NetJ10_5: J10.5 ; port MISO
NetLED1_1: LED1.1(K) R1.2
NetLED2_1: LED2.1(K) R2.2
NetR1_1: R1.1 U1.3(RXD) ; port RX
NetR2_1: R2.1 R3.2 U1.2(TXD)
NetR3_1: R3.1 ; port TX

Not connected (* = marked no-connect by the designer): J3 A8(SBU1) B8(SBU2); U1 4(V3)* 9(~{CTS})* 10(~{DSR})* 11(~{RI})* 12(~{DCD})* 13(~{DTR})* 14(~{RTS})* 15(RS232)*

### Notes on the sheet
- Title:
- Drawn By:
- Page Contents:
- Checked By:
- Subtitle:
- University Of Moratuwa
- Moratuwa
- Size:
- Date:
- File:
- Email:
- A4
- lasithnawanjaan123@gmail.com
- Lasith Haputhanthri
- Number:
- Time:
- Revision:
- Sheet
- of
- Katubedda
- 10500
- Sri Lanka

### Library data of the parts
C1 C3 = CMP-2100-03601-2: as C11 on sheet MCU; Height: 0.9mm; Voltage: 50 V; ComponentLink2Description: Datasheet; Device Class L2: Capacitors; Temperature Range High: +125°C; Category: Cap; Footprint Url: http://www.yageo.com/exep/pages/download/literatures/UPY-C_GEN_24.pdf; ComponentLink2URL: http://www.yageo.com/documents/recent/UPY-GPHC_X7R_6.3V-to-50V_18.pdf; Package: CC0603-DA; Temperature: -55°C to +125°C; Voltage Rating: 50 V; Temperature Characteristic: X7R; Device Class L1: Passive Components; Temperature Range Low: -55°C; Manufacturer Part Number: CC0603KRX7R9BB104; RoHS: TRUE; Automotive: No; Device Class L3: Ceramic Capacitors; Octopart: https://octopart.com/cc0603krx7r9bb104-yageo-42244635; Mouser Description: Multilayer Ceramic Capacitor, CC Series, 0.1 - F, - 10%, X7R, 50 V, 0603 [1608 Metric]; Lead Free: Yes; Digikey Description: CAP CER 0.1UF 50V X7R 0603
C2 = CL10A106KP8NNNC: as C14 on sheet MCU; Datasheet Link: https://datasheet.datasheetarchive.com/originals/distributors/Datasheets-DGA10/2415998.pdf; Height: 0.9mm; Manufacturer_Part_Number: CL10A106KP8NNNC; Mouser Part Number: 187-CL10A106KP8NNNC; Mouser Price/Stock: https://www.mouser.co.uk/ProductDetail/Samsung-Electro-Mechanics/CL10A106KP8NNNC?qs=X6jEic%2FHinAlyfRHj7fKwg%3D%3D; Arrow Part Number: CL10A106KP8NNNC; Arrow Price/Stock: https://www.arrow.com/en/products/cl10a106kp8nnnc/samsung-electro-mechanics?region=europe
C4 C5 = CMP-1659-00026-1: as C12 on sheet MCU; ComponentLink1URL: http://www.yageo.com/; PackageReference: 0603; ComponentLink1Description: Manufacturer URL; PackageDescription: 2-Pin Surface Mount Device, Body 1.6 x 0.8 mm; DatasheetVersion: Rev. 8, 08/2011; ComponentLink2Description: Datasheet; ComponentLink2URL: http://www.yageo.com/documents/recent/UPY-GP_NP0_16V-to-50V_8.pdf
J3 = TYPE-C-31-M-12: USB Connectors 24 Receptacle 1 8.94*7.3mm RoHS; MF: HRO Electronics Co., Ltd.; Price: None; Value: *; SnapEDA_Link: https://www.snapeda.com/parts/TYPE-C-31-M-12/HRO+Electronics+Co.%252C+Ltd./view-part/?ref=snap; Package: Package; Availability: Not in stock; Check_prices: https://www.snapeda.com/parts/TYPE-C-31-M-12/HRO+Electronics+Co.%252C+Ltd./view-part/?ref=eda; MP: TYPE-C-31-M-12
J10 = M20-9980346: Connector; Manufacturer_Name: Harwin; Datasheet Link: https://cdn.harwin.com/pdfs/M20-998.pdf; Height: 8.68mm; Manufacturer_Part_Number: M20-9980346; Mouser Part Number: 855-M20-9980346; Mouser Price/Stock: https://www.mouser.co.uk/ProductDetail/Harwin/M20-9980346?qs=%252Bk6%2F5FB6qrmHk2P20oz3FA%3D%3D
LED1 LED2 = LTST-C191KRKT: LED; Manufacturer_Name: Lite-On; Datasheet Link: http://www.mouser.com/ds/2/239/S_110_LTST-C191KRKT-539838.pdf; Height: 0.55mm; Manufacturer_Part_Number: LTST-C191KRKT; Mouser Part Number: 859-LTST-C191KRKT; Mouser Price/Stock: https://www.mouser.co.uk/ProductDetail/Lite-On/LTST-C191KRKT?qs=BAIUz4Y8PJBLfOhzue0q%252BA%3D%3D; Arrow Part Number: LTST-C191KRKT; Arrow Price/Stock: https://www.arrow.com/en/products/ltst-c191krkt/lite-on-technology?region=nac
R1-R3 = CMP-03412-043191-1: as R7 on sheet MCU; Length: 0.063inch; Packaging: Tape and Reel; Tolerance: 1%; RoHS Compliant: Yes; Series: AF; Temperature Coefficient: 100ppm/°C; Case/Package: 0603; Height: 0.022inch; Min Operating Temperature: -55°C; Resistor Type: Thick Film; Features: Moisture Resistant; Width: 0.031inch; Number of Terminations: 2; Max Operating Temperature: 155°C
R4 = 0603WAF5101T5E: 0603WAF5101T5E Resistor; Manufacturer_Name: UNI-ROYAL(Uniroyal Elec); Datasheet Link: https://datasheet.lcsc.com/szlcsc/Uniroyal-Elec-0603WAF5101T5E_C23186.pdf; Height: 0.55mm; Manufacturer_Part_Number: 0603WAF5101T5E
R5 = 0603WAF5101T5E: 0603WAF5101T5EResistor; Manufacturer_Name: UNI-ROYAL(Uniroyal Elec); Datasheet Link: https://datasheet.lcsc.com/szlcsc/Uniroyal-Elec-0603WAF5101T5E_C23186.pdf; Height: 0.55mm; Manufacturer_Part_Number: 0603WAF5101T5E
U1 = CH340G: USB Interface Integrated Circuit; MF: WCH; Value: *; SnapEDA_Link: https://www.snapeda.com/parts/Ch340G/WCH/view-part/?ref=snap; MP: Ch340G; Check_prices: https://www.snapeda.com/parts/Ch340G/WCH/view-part/?ref=eda; Availability: Not in stock; Price: None; Package: None
Y1 = CMP-2000-05039-3: ABM8G-12.000MHZ-18-D2Y-T Crystal 12MHz ±20ppm (Tol) ±30ppm (Stability) 18pF FUND 120Ω 4-Pin SMD T/R; Series Resistance: 120R; Max Operating Temperature: 85°C; Mount: Surface Mount; Width: 2.5mm; Series: ABM8G; Termination: SMD/SMT; Frequency Tolerance: 20ppm; Tolerance: 20ppm; Min Operating Temperature: -40°C; Operating Frequency: 12 MHz; Depth: 2.5mm; Load Capacitance: 18pF; Number of Pins: 4; Length: 3.2mm; Radiation Hardening: No; Frequency Stability: 30ppm; Height: 1mm; Packaging: Tape and Reel; Package Quantity: 1000; ESR (Equivalent Series Resistance): 120R; Lead Free: Lead Free; Frequency: 12MHz; Case/Package: CSMD

## Sheet Ultrasonic Sensors.SchDoc: Title
size A4; Date: *******; ApprovedBy: *******; CheckedBy: Yasiru; Author: *******; CompanyName: *******; DrawnBy: Name; Engineer: *******; Organization: *******; Address1: *******; Address2: *******; Address3: *******; Address4: *******; DocumentNumber: Doc Num; Revision: *******; SheetNumber: 7; SheetTotal: 11; Subtitle: Ultrasonic Sensor JST; Project: Resturant Robot; VersionRevision: III; TotalSheet: 11; CurrentTime: *******; CurrentDate: *******; Time: *******; DocumentFullPathAndName: *******; DocumentName: *******; ModifiedDate: *******; ImagePath: *******; ProjectName: *******; Application_BuildNumber: *******
Used 3 times, as channels U_Ultrasonic Sensors1, U_Ultrasonic Sensors2, U_Ultrasonic Sensor3. Parts and nets are listed once, with the designators drawn on the sheet.
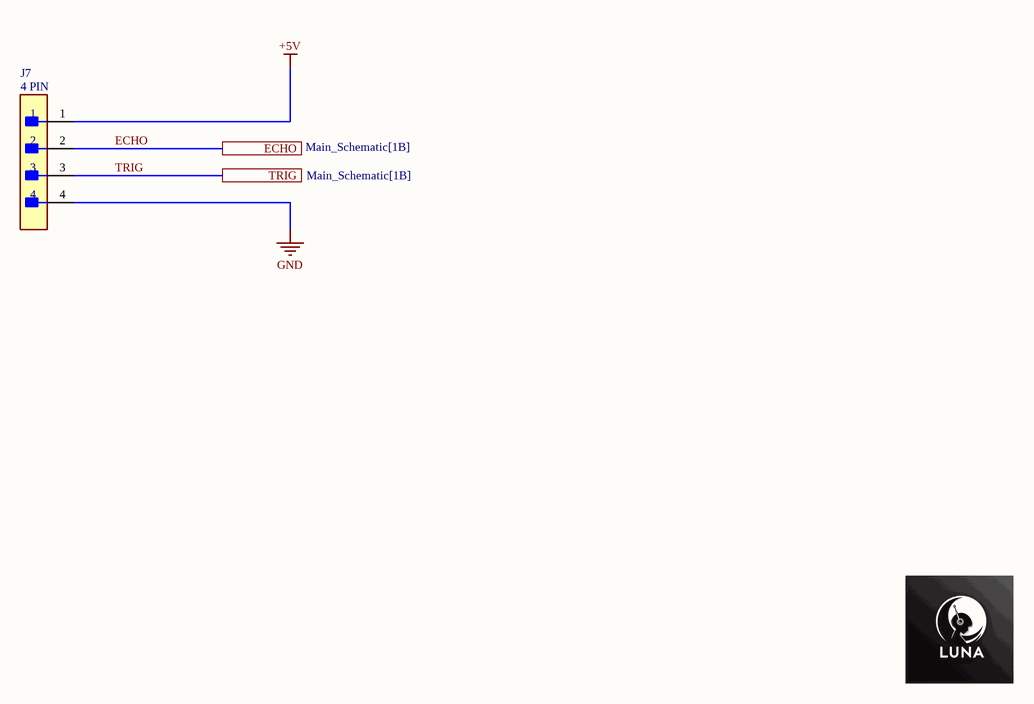
[diagram p6: Ultrasonic Sensors.SchDoc]

### Parts
J7  4 PIN  [FP-B4B-XH-A_LF_SN-MFG]

### Ports
ECHO (see Main_Schematic[1B]), TRIG (see Main_Schematic[1B])

### Nets
+5V: J7.1
GND: J7.4
ECHO: J7.2 ; port ECHO
TRIG: J7.3 ; port TRIG

### Channels
U_Ultrasonic Sensors1: designators end in _U_Ultrasonic_Sensors1; ports ECHO=ECHO TRIG=TRIG
U_Ultrasonic Sensors2: designators end in _U_Ultrasonic_Sensors2; ports ECHO=ECHO TRIG=TRIG
U_Ultrasonic Sensor3: designators end in _U_Ultrasonic_Sensor3; ports ECHO=ECHO TRIG=TRIG

### Notes on the sheet
- Title:
- Drawn By:
- Page Contents:
- Checked By:
- Subtitle:
- University Of Moratuwa
- Moratuwa
- Size:
- Date:
- File:
- Email:
- A4
- lasithnawanjaan123@gmail.com
- Lasith Haputhanthri
- Number:
- Time:
- Revision:
- Sheet
- of
- Katubedda
- 10500
- Sri Lanka

### Library data of the parts
J7 = CMP-17439-000250-1: as J4 on sheet Encoders; Orientation: Straight; Contact Type: Male Pin; Contact Finish - Mating: TIN; Series: XH; Max Voltage Rating (AC): 250V; Lead Pitch: 2.5mm; Contact Shape: Square; Insulation Color: Natural; Termination: Solder; Lead Free: Lead Free; Voltage Rating (AC): 250V; Number of Rows: 1; Flammability Rating: UL94 V-0; Number of Positions: 4; Max Operating Temperature: 85°C; Package Quantity: 500; Mount: Through Hole; REACH SVHC: No SVHC; Connector Type: Header; Insulation Material: Nylon; Fastening Type: Detent; Min Operating Temperature: -25°C; Housing Color: White; Packaging: Bulk; Contact Plating: Tin; Contact Material: Brass; Max Voltage Rating (DC): 250V; Housing Material: Polyamide; Color: Natural; Material: Polyamide; Pitch: 2.5mm; Depth: 5.75mm; Current Rating: 3A; Length: 12.4mm

## Sheet PowerMCU.SchDoc: Title
size A4; Date: *******; ApprovedBy: *******; CheckedBy: Yasiru; Author: *******; CompanyName: *******; DrawnBy: Name; Engineer: *******; Organization: *******; Address1: *******; Address2: *******; Address3: *******; Address4: *******; DocumentNumber: Doc Num; Revision: *******; SheetNumber: 5; SheetTotal: 11; Subtitle: Power Supply for MCU; Project: Resturant Robot; VersionRevision: III; TotalSheet: 11; CurrentTime: *******; CurrentDate: *******; Time: *******; DocumentFullPathAndName: *******; DocumentName: *******; ModifiedDate: *******; ImagePath: *******; ProjectName: *******; Application_BuildNumber: *******
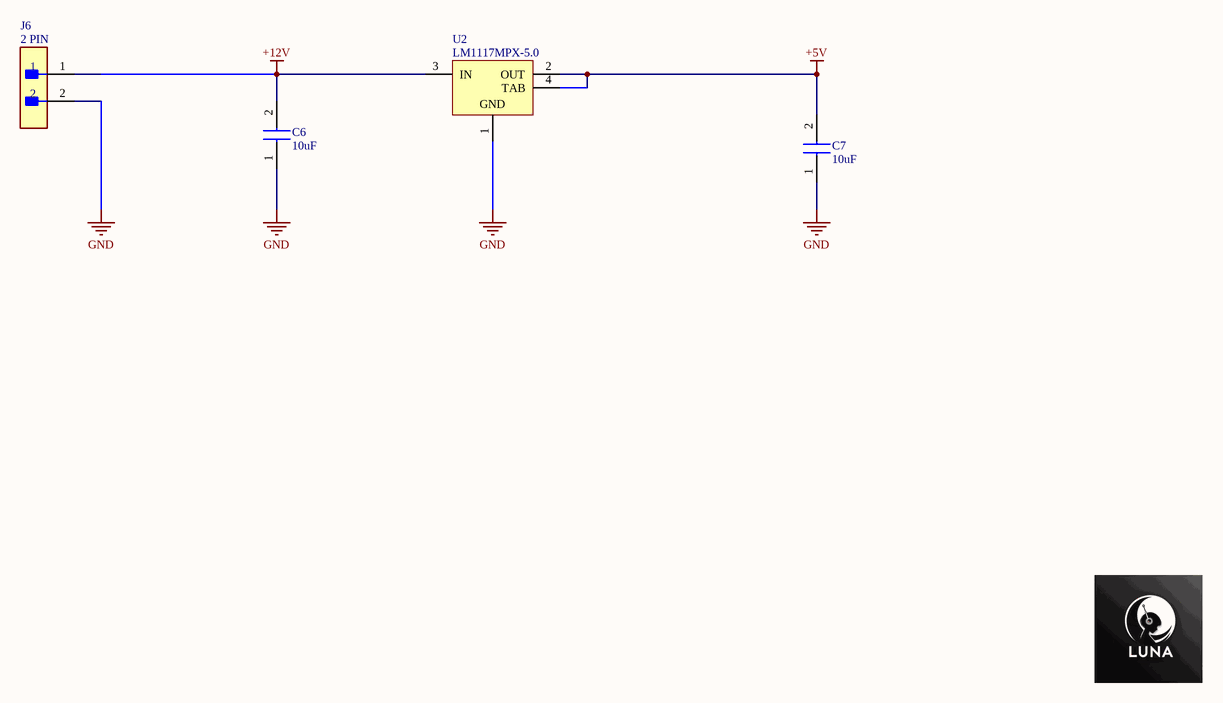
[diagram p7: PowerMCU.SchDoc]

### Parts
C6  10uF  [CAPC1608X90N]
C7  10uF  [CAPC1608X90N]
J6  2 PIN  [FP-B2B-XH-AM_LF_SN-MFG]
U2  LM1117MPX-5.0  [DCY0004A_L]

### Nets
+5V: C7.2 U2.2(OUT) U2.4(TAB)
+12V: C6.2 J6.1 U2.3(IN)
GND: C6.1 C7.1 J6.2 U2.1(GND)

### Notes on the sheet
- Title:
- Drawn By:
- Page Contents:
- Checked By:
- Subtitle:
- University Of Moratuwa
- Moratuwa
- Size:
- Date:
- File:
- Email:
- A4
- lasithnawanjaan123@gmail.com
- Lasith Haputhanthri
- Number:
- Time:
- Revision:
- Sheet
- of
- Katubedda
- 10500
- Sri Lanka

### Library data of the parts
C6 C7 = CL10A106KP8NNNC: as C14 on sheet MCU; Datasheet Link: https://datasheet.datasheetarchive.com/originals/distributors/Datasheets-DGA10/2415998.pdf; Height: 0.9mm; Manufacturer_Part_Number: CL10A106KP8NNNC; Mouser Part Number: 187-CL10A106KP8NNNC; Mouser Price/Stock: https://www.mouser.co.uk/ProductDetail/Samsung-Electro-Mechanics/CL10A106KP8NNNC?qs=X6jEic%2FHinAlyfRHj7fKwg%3D%3D; Arrow Part Number: CL10A106KP8NNNC; Arrow Price/Stock: https://www.arrow.com/en/products/cl10a106kp8nnnc/samsung-electro-mechanics?region=europe
J6 = CMP-17439-000037-1: CONN HEADER VERT 2POS 2.5MM; Max Voltage Rating (AC): 250V; Connector Type: Male Pin; Contact Resistance: 20mR; Max Current Rating: 3A; Number of Positions: 2; Series: XH; Contact Material: Brass; Mount: Through Hole; Housing Material: Polyamide; Contact Plating: Tin; Termination: Solder; Max Operating Temperature: 85°C; Depth: 5.75mm; Packaging: Bulk; Min Operating Temperature: -25°C; Contact Type: Male Pin; Color: Green; Pitch: 2.5mm; Length: 7.4mm; Lead Free: Lead Free; Number of Rows: 1; Fastening Type: Detent; Housing Color: White; Orientation: Straight
U2 = CMP-0062-01637-4: 800mA Low-Dropout Linear Regulator, 4-pin SOT-223; Manufacturer: Texas Instruments; High-Reliability: Y; PowerWise: N; PackageTopMarking: XYTT*N06A; CompType: LDO IC; PackageDescription: Molded SOT-223, 6.50 x 3.56 x 1.6mm Body, 4 Lead, 2.3mm Pitch; PackageReference: DCY0004A; ComponentLink1URL: http://www.ti.com/general/docs/lit/getliterature.tsp?genericPartNumber=LM1117-N&fileType=pdf; Code_JEDEC: TO-261-AA; ComponentLink1Description: Datasheet URL; PartNumber: LM1117MPX-5.0; Code_IPC: SOT223-4; RoHS: N; PinCount: 4

## Sheet Power_Supply_Motor.SchDoc: Title
size A4; Date: *******; ApprovedBy: *******; CheckedBy: Yasiru; Author: *******; CompanyName: *******; DrawnBy: Name; Engineer: *******; Organization: *******; Address1: *******; Address2: *******; Address3: *******; Address4: *******; DocumentNumber: Doc Num; Revision: *******; SheetNumber: 6; SheetTotal: 11; Subtitle: Power Supply; Sensors and Drivers; Project: Resturant Robot; VersionRevision: III; TotalSheet: 11; CurrentTime: *******; CurrentDate: *******; Time: *******; DocumentFullPathAndName: *******; DocumentName: *******; ModifiedDate: *******; ImagePath: *******; ProjectName: *******; Application_BuildNumber: *******
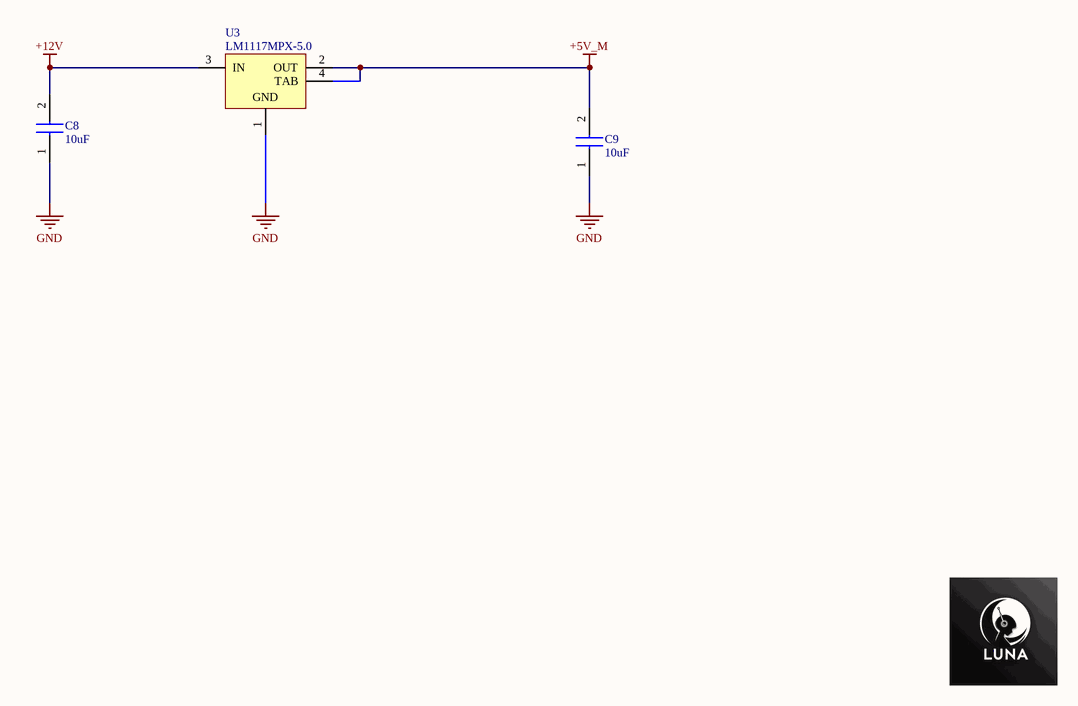
[diagram p8: Power_Supply_Motor.SchDoc]

### Parts
C8  10uF  [CAPC1608X90N]
C9  10uF  [CAPC1608X90N]
U3  LM1117MPX-5.0  [DCY0004A_L]

### Nets
+5V_M: C9.2 U3.2(OUT) U3.4(TAB)
+12V: C8.2 U3.3(IN)
GND: C8.1 C9.1 U3.1(GND)

### Notes on the sheet
- Title:
- Drawn By:
- Page Contents:
- Checked By:
- Subtitle:
- University Of Moratuwa
- Moratuwa
- Size:
- Date:
- File:
- Email:
- A4
- lasithnawanjaan123@gmail.com
- Lasith Haputhanthri
- Number:
- Time:
- Revision:
- Sheet
- of
- Katubedda
- 10500
- Sri Lanka

### Library data of the parts
C8 C9 = CL10A106KP8NNNC: as C14 on sheet MCU; Datasheet Link: https://datasheet.datasheetarchive.com/originals/distributors/Datasheets-DGA10/2415998.pdf; Height: 0.9mm; Manufacturer_Part_Number: CL10A106KP8NNNC; Mouser Part Number: 187-CL10A106KP8NNNC; Mouser Price/Stock: https://www.mouser.co.uk/ProductDetail/Samsung-Electro-Mechanics/CL10A106KP8NNNC?qs=X6jEic%2FHinAlyfRHj7fKwg%3D%3D; Arrow Part Number: CL10A106KP8NNNC; Arrow Price/Stock: https://www.arrow.com/en/products/cl10a106kp8nnnc/samsung-electro-mechanics?region=europe
U3 = CMP-0062-01637-4: as U2 on sheet PowerMCU; PackageDescription: Molded SOT-223, 6.50 x 3.56 x 1.6mm Body, 4 Lead, 2.3mm Pitch; PackageReference: DCY0004A; ComponentLink1URL: http://www.ti.com/general/docs/lit/getliterature.tsp?genericPartNumber=LM1117-N&fileType=pdf; Code_JEDEC: TO-261-AA; ComponentLink1Description: Datasheet URL; PartNumber: LM1117MPX-5.0; Code_IPC: SOT223-4; RoHS: N; PinCount: 4

## Sheet 7 segment.SchDoc: Reaturant Robot
size A4; Date: *******; ApprovedBy: *******; CheckedBy: Yasiru; Author: *******; CompanyName: *******; DrawnBy: Name; Engineer: *******; Organization: *******; Address1: *******; Address2: *******; Address3: *******; Address4: *******; DocumentNumber: 10; Revision: *******; SheetNumber: 9; SheetTotal: 11; Subtitle: 7 segment Display; Project: Reaturant Robot; VersionRevision: III; TotalSheet: 11; CurrentTime: *******; CurrentDate: *******; Time: *******; DocumentFullPathAndName: *******; DocumentName: *******; ModifiedDate: *******; ImagePath: *******; ProjectName: *******; Application_BuildNumber: *******
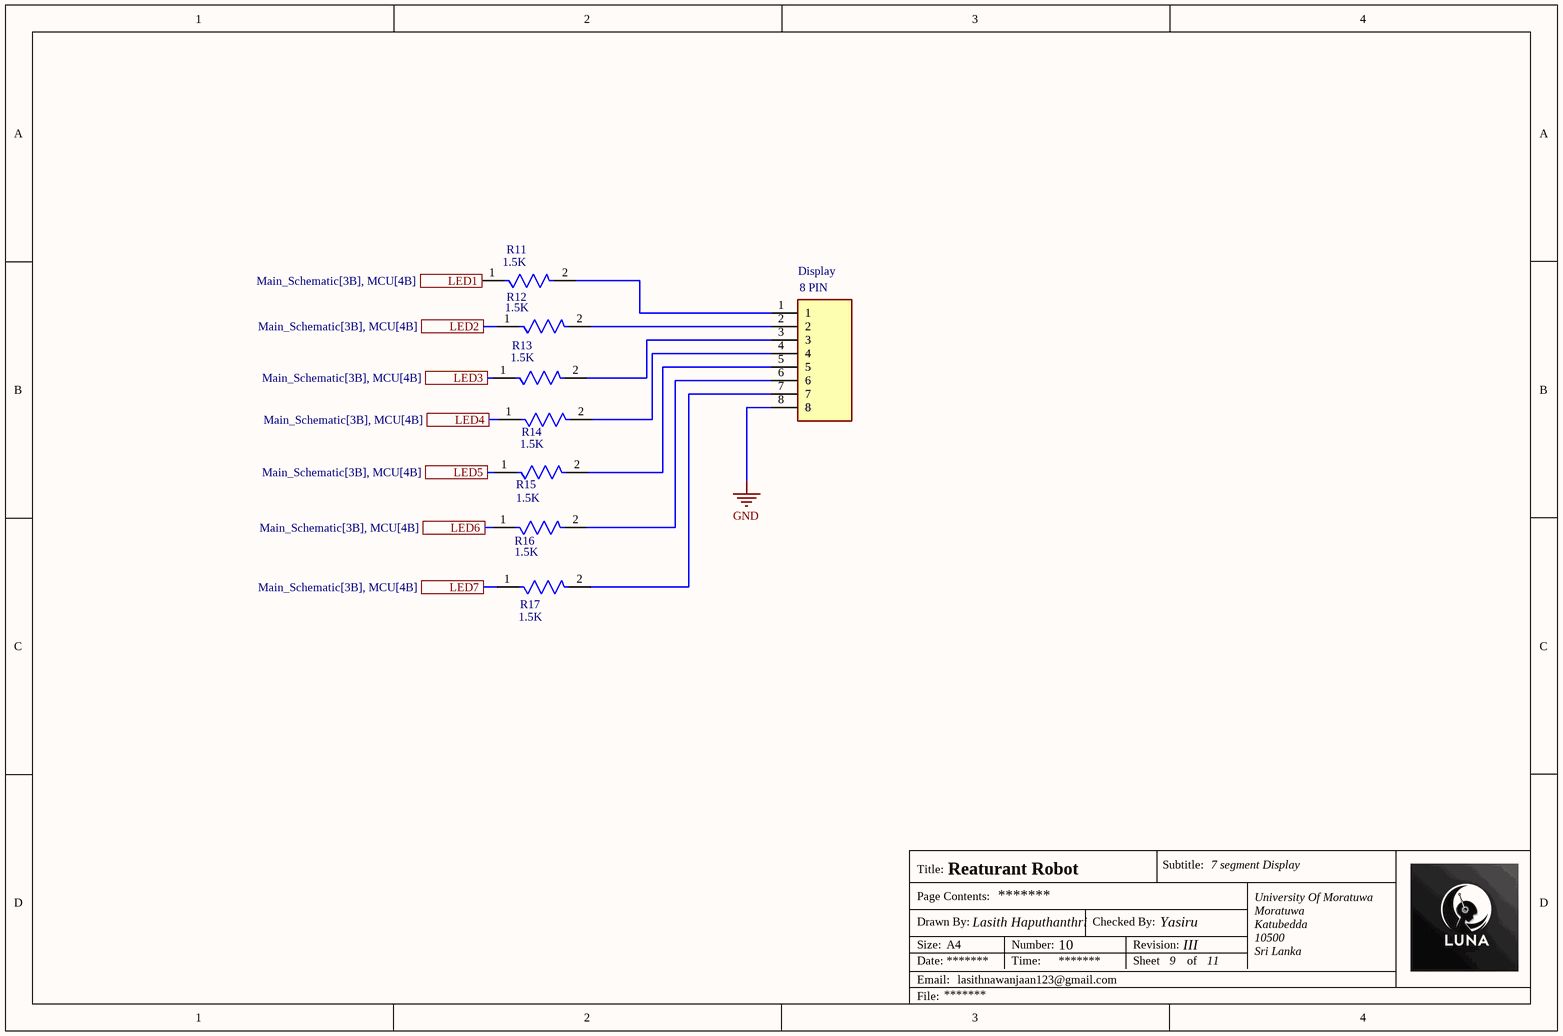
[diagram p9: 7 segment.SchDoc]

### Parts
Display  8 PIN  [SHDR8W60P0X250_1X8_2250X640X880P]
R11  1.5K  [FP-AF0603-IPC_B]
R12  1.5K  [FP-AF0603-IPC_B]
R13  1.5K  [FP-AF0603-IPC_B]
R14  1.5K  [FP-AF0603-IPC_B]
R15  1.5K  [FP-AF0603-IPC_B]
R16  1.5K  [FP-AF0603-IPC_B]
R17  1.5K  [FP-AF0603-IPC_B]

### Ports
LED1 (see Main_Schematic[3B], MCU[4B]), LED2 (see Main_Schematic[3B], MCU[4B]), LED3 (see Main_Schematic[3B], MCU[4B]), LED4 (see Main_Schematic[3B], MCU[4B]), LED5 (see Main_Schematic[3B], MCU[4B]), LED6 (see Main_Schematic[3B], MCU[4B]), LED7 (see Main_Schematic[3B], MCU[4B])

### Nets
GND: Display.8
NetDisplay_1: Display.1 R11.2
NetDisplay_2: Display.2 R12.2
NetDisplay_3: Display.3 R13.2
NetDisplay_4: Display.4 R14.2
NetDisplay_5: Display.5 R15.2
NetDisplay_6: Display.6 R16.2
NetDisplay_7: Display.7 R17.2
NetR11_1: R11.1 ; port LED1
NetR12_1: R12.1 ; port LED2
NetR13_1: R13.1 ; port LED3
NetR14_1: R14.1 ; port LED4
NetR15_1: R15.1 ; port LED5
NetR16_1: R16.1 ; port LED6
NetR17_1: R17.1 ; port LED7

### Notes on the sheet
- Title:
- Drawn By:
- Page Contents:
- Checked By:
- Subtitle:
- University Of Moratuwa
- Moratuwa
- Size:
- Date:
- File:
- Email:
- A4
- lasithnawanjaan123@gmail.com
- Lasith Haputhanthri
- Number:
- Time:
- Revision:
- Sheet
- of
- Katubedda
- 10500
- Sri Lanka

### Library data of the parts
Display = B08B-XASK-1__LF__SN_: Connector; Manufacturer_Name: JST (JAPAN SOLDERLESS TERMINALS); Manufacturer_Part_Number: B08B-XASK-1 (LF)(SN); Datasheet Link: http://uk.rs-online.com/web/p/products/1667521; Height: 8.8mm
R11-R17 = CMP-03412-043191-1: Anti-Sulfurated Chip Resistors Automotive Grade 1.5kΩ 1% 100ppm/°C 0603; Resistance: 1.5kR; Max Power Dissipation: 100mW; Length: 0.063inch; Packaging: Tape and Reel; Tolerance: 1%; RoHS Compliant: Yes; Series: AF; Temperature Coefficient: 100ppm/°C; Case/Package: 0603; Height: 0.022inch; Min Operating Temperature: -55°C; Resistor Type: Thick Film; Features: Moisture Resistant; Width: 0.031inch; Number of Terminations: 2; Max Operating Temperature: 155°C

## Sheet Proximity Sensors.SchDoc: Title
size A4; Date: *******; ApprovedBy: *******; CheckedBy: Yasiru; Author: *******; CompanyName: *******; DrawnBy: Name; Engineer: *******; Organization: *******; Address1: *******; Address2: *******; Address3: *******; Address4: *******; DocumentNumber: Doc Num; Revision: *******; SheetNumber: 11; SheetTotal: 11; Subtitle: Proximity Sensors; Project: Resturant Robot; VersionRevision: III; TotalSheet: 11; CurrentTime: *******; CurrentDate: *******; Time: *******; DocumentFullPathAndName: *******; DocumentName: *******; ModifiedDate: *******; ImagePath: *******; ProjectName: *******; Application_BuildNumber: *******
Used 4 times, as channels U_Proximity Sensors1, U_Proximity Sensors2, U_Proximity Sensors3, U_Proximity Sensors4. Parts and nets are listed once, with the designators drawn on the sheet.
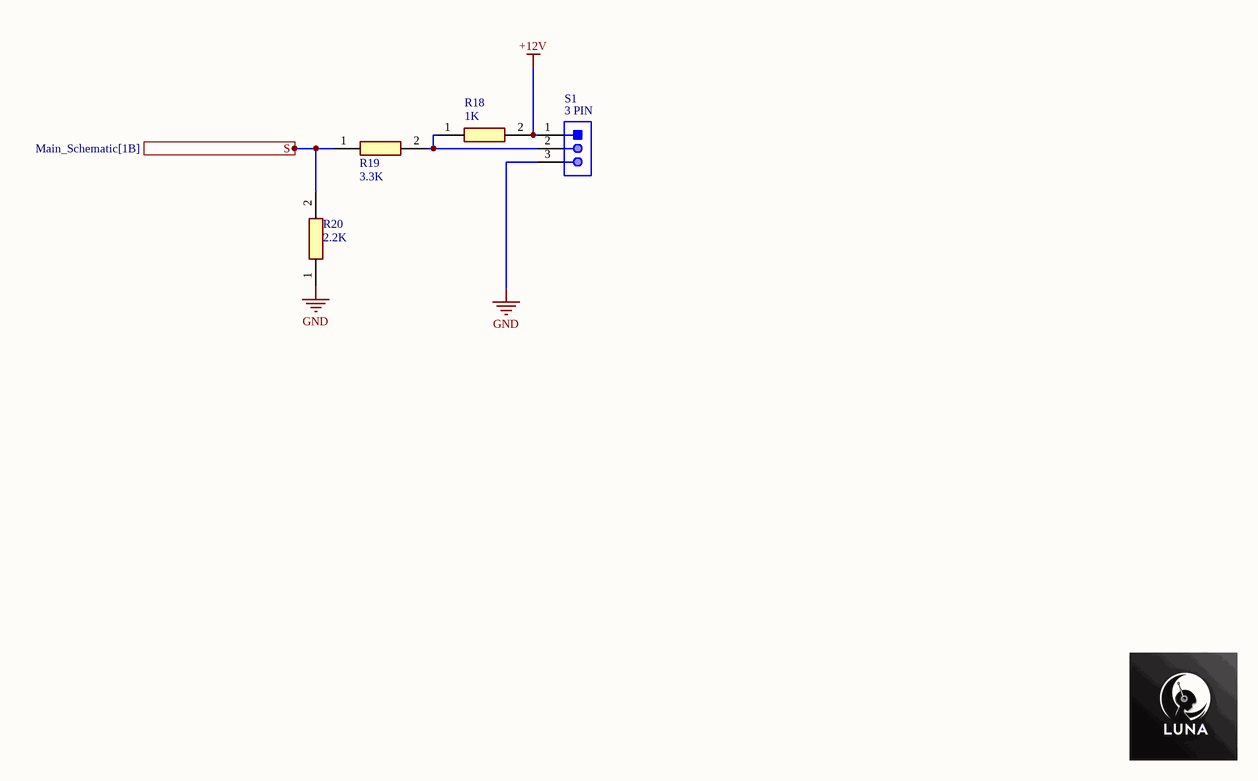
[diagram p10: Proximity Sensors.SchDoc]

### Parts
R18  1K  [RESC1608X55N]
R19  3.3K  [RESC1608X55N]
R20  2.2K  [ERJ3EKF1000V]
S1  3 PIN  [TECO-171825-3_V]

### Ports
S (see Main_Schematic[1B])

### Nets
+12V: R18.2 S1.1
GND: R20.1 S1.3
S: R19.1 R20.2 ; port S
NetR18_1: R18.1 R19.2 S1.2

### Channels
U_Proximity Sensors1: designators end in _U_Proximity_Sensors1; ports S=NetR19_U_Proximity_Sensors1_1
U_Proximity Sensors2: designators end in _U_Proximity_Sensors2; ports S=NetR19_U_Proximity_Sensors2_1
U_Proximity Sensors3: designators end in _U_Proximity_Sensors3; ports S=NetR19_U_Proximity_Sensors3_1
U_Proximity Sensors4: designators end in _U_Proximity_Sensors4; ports S=NetR19_U_Proximity_Sensors4_1

### Notes on the sheet
- Title:
- Drawn By:
- Page Contents:
- Checked By:
- Subtitle:
- University Of Moratuwa
- Moratuwa
- Size:
- Date:
- File:
- Email:
- A4
- lasithnawanjaan123@gmail.com
- Lasith Haputhanthri
- Number:
- Time:
- Revision:
- Sheet
- of
- Katubedda
- 10500
- Sri Lanka

### Library data of the parts
R18 = RC0603FR-071KL: Resistor; Manufacturer_Name: YAGEO; Datasheet Link: https://www.yageo.com/upload/media/product/productsearch/datasheet/rchip/PYu-RC_Group_51_RoHS_L_12.pdf; Height: 0.55mm; Manufacturer_Part_Number: RC0603FR-071KL; Mouser Part Number: 603-RC0603FR-071KL; Mouser Price/Stock: https://www.mouser.co.uk/ProductDetail/YAGEO/RC0603FR-071KL?qs=VU8sRB4EgwApHsk4rF%2F3zg%3D%3D; Arrow Part Number: RC0603FR-071KL; Arrow Price/Stock: https://www.arrow.com/en/products/rc0603fr-071kl/yageo?region=nac
R19 = RMCF0603JT3K30: Resistor RMCF0603JT3K30; Manufacturer_Name: Stackpole Electronics; Datasheet Link: https://www.seielect.com/Catalog/SEI-RMCF_RMCP.pdf; Height: 0.55mm; Manufacturer_Part_Number: RMCF0603JT3K30
R20 = ERJ3GEYJ222V: Resistor; Manufacturer_Name: Panasonic; Datasheet Link: http://docs-europe.electrocomponents.com/webdocs/13ba/0900766b813ba21b.pdf; Height: 0.55mm; Manufacturer_Part_Number: ERJ3GEYJ222V; Arrow Part Number: ERJ3GEYJ222V; Arrow Price/Stock: https://www.arrow.com/en/products/erj-3geyj222v/panasonic?region=nac
S1 = CMP-2000-07494-1: Male Header, Pitch 2.5 mm, 1 x 3 Position, Height 10.4 mm, Tail Length 3.6 mm, / -20 to 95 degC / , RoHS, Bulk; Manufacturer: TE Connectivity; Mating Alignment: Yes(With); Tail Length: 0.142inch; Mating Post Length: 7.5mm; PCB Thickness: 0.063inch; PCB Mount Alignment: No(Without); Voltage Rating: 350V; Max Voltage Rating (AC): 250V; Plating Thickness: 0.8um; PCB Mounting Orientation: Vertical; Number of Positions: 3; PCB Mount Retention: Without; Max Current Rating: 3.5A; Max Voltage Rating (DC): 350.25kV; Pitch: 2.5mm; Approvals: UL; Contact Resistance: 20mOhm; Mount: ThroughHole; Length: 7.5mm; Orientation: Straight; Contact Mating Length: 0.295inch; Contact Material: Brass; Housing Material: Nylon; Package Description: Male Header, Pitch 2.5 mm, 1 x 3 Position, Height 10.4 mm, Tail Length 3.6 mm; Colour: Natural; Backwall/Post Interruptions: No(Without); Min Operating Temperature: -20degC; Mating Retention: Yes(With); Connector Type: Header; Packaging: Bag; RoHSCompliant: True; Package Reference: 171825-3; Contact Shape: Square; Strain Relief: No(Without); Contact Gender: Male; Number of Contacts: 3; Manufacturer URL: http://www.te.com/; Height: 0.409inch; Contact Retention: No(Without); Datasheet Version: Rev. Y3, 12/2016; Panel Mount Retention: No(Without); Datasheet URL: http://www.te.com/commerce/DocumentDelivery/DDEController?Action=showdoc&DocId=Customer+Drawing%7F171825%7FY3%7Fpdf%7FEnglish%7FENG_CD_171825_Y3.pdf%7F171825-3; Termination: Solder; Mounting Technology: ThroughHole; Max Operating Temperature: 95degC; Flammability Rating: UL94V-0; REACH SVHC: NoSVHC; Housing Colour: Natural; Package Quantity: 1000; Number of Rows: 1; Depth: 4.9mm; Contact Plating: Tin

## Nets that join several sheets
+5V: MCU (11 pins), Reset (R6.2), U_Encoders (J4_U_Encoders#1.1), U_Encoders (J4_U_Encoders#2.1), Cording (9 pins), U_Ultrasonic Sensors1 (J7_U_Ultrasonic_Sensors1.1), U_Ultrasonic Sensors2 (J7_U_Ultrasonic_Sensors2.1), U_Ultrasonic Sensor3 (J7_U_Ultrasonic_Sensor3.1), PowerMCU (C7.2 U2.2 U2.4)
+5V_M: U_Motor Drivers1 (J5_U_Motor_Drivers1.1), U_Motor Drivers2 (J5_U_Motor_Drivers2.1), Power_Supply_Motor (C9.2 U3.2 U3.4)
+12V: PowerMCU (C6.2 J6.1 U2.3), Power_Supply_Motor (C8.2 U3.3), U_Proximity Sensors1 (R18_U_Proximity_Sensors1.2 S1_U_Proximity_Sensors1.1), U_Proximity Sensors2 (R18_U_Proximity_Sensors2.2 S1_U_Proximity_Sensors2.1), U_Proximity Sensors3 (R18_U_Proximity_Sensors3.2 S1_U_Proximity_Sensors3.1), U_Proximity Sensors4 (R18_U_Proximity_Sensors4.2 S1_U_Proximity_Sensors4.1)
GND: MCU (17 pins), Reset (C10.1 SW1.1 SW1.2), U_Encoders (J4_U_Encoders#1.4), U_Motor Drivers1 (J5_U_Motor_Drivers1.2), U_Motor Drivers2 (J5_U_Motor_Drivers2.2), U_Encoders (J4_U_Encoders#2.4), Cording (17 pins), U_Ultrasonic Sensors1 (J7_U_Ultrasonic_Sensors1.4), U_Ultrasonic Sensors2 (J7_U_Ultrasonic_Sensors2.4), U_Ultrasonic Sensor3 (J7_U_Ultrasonic_Sensor3.4), PowerMCU (C6.1 C7.1 J6.2 U2.1), Power_Supply_Motor (C8.1 C9.1 U3.1), 7 segment (Display.8), U_Proximity Sensors1 (R20_U_Proximity_Sensors1.1 S1_U_Proximity_Sensors1.3), U_Proximity Sensors2 (R20_U_Proximity_Sensors2.1 S1_U_Proximity_Sensors2.3), U_Proximity Sensors3 (R20_U_Proximity_Sensors3.1 S1_U_Proximity_Sensors3.3), U_Proximity Sensors4 (R20_U_Proximity_Sensors4.1 S1_U_Proximity_Sensors4.3)
ECHO: MCU (U4.97), U_Ultrasonic Sensors1 (J7_U_Ultrasonic_Sensors1.2)
ECHO: MCU (U4.95), U_Ultrasonic Sensors2 (J7_U_Ultrasonic_Sensors2.2)
ECHO: MCU (U4.93), U_Ultrasonic Sensor3 (J7_U_Ultrasonic_Sensor3.2)
EN1A: MCU (U4.6), U_Encoders (J4_U_Encoders#1.2)
EN1A: MCU (U4.45), U_Encoders (J4_U_Encoders#2.2)
EN1B: MCU (U4.7), U_Encoders (J4_U_Encoders#1.3)
EN1B: MCU (U4.46), U_Encoders (J4_U_Encoders#2.3)
ENL: MCU (U4.17 U4.18 U4.73), U_Motor Drivers2 (J5_U_Motor_Drivers2.4 J5_U_Motor_Drivers2.5 J5_U_Motor_Drivers2.6)
ENL: MCU (U4.16), U_Motor Drivers1 (J5_U_Motor_Drivers1.6)
ENR: MCU (U4.15), U_Motor Drivers1 (J5_U_Motor_Drivers1.5)
LPWM: MCU (U4.75), U_Motor Drivers1 (J5_U_Motor_Drivers1.4)
NetJ10_3: MCU (U4.20), Cording (J10.3)
NetJ10_4: MCU (U4.21), Cording (J10.4)
NetJ10_5: MCU (U4.22), Cording (J10.5)
NetR1_1: MCU (U4.3), Cording (R1.1 U1.3)
NetR3_1: MCU (U4.2), Cording (R3.1)
NetR11_1: MCU (U4.35), 7 segment (R11.1)
NetR12_1: MCU (U4.36), 7 segment (R12.1)
NetR13_1: MCU (U4.37), 7 segment (R13.1)
NetR14_1: MCU (U4.38), 7 segment (R14.1)
NetR15_1: MCU (U4.39), 7 segment (R15.1)
NetR16_1: MCU (U4.40), 7 segment (R16.1)
NetR17_1: MCU (U4.41), 7 segment (R17.1)
NetR19_U_Proximity_Sensors1_1: MCU (U4.89), U_Proximity Sensors1 (R19_U_Proximity_Sensors1.1 R20_U_Proximity_Sensors1.2)
NetR19_U_Proximity_Sensors2_1: MCU (U4.88), U_Proximity Sensors2 (R19_U_Proximity_Sensors2.1 R20_U_Proximity_Sensors2.2)
NetR19_U_Proximity_Sensors3_1: MCU (U4.87), U_Proximity Sensors3 (R19_U_Proximity_Sensors3.1 R20_U_Proximity_Sensors3.2)
NetR19_U_Proximity_Sensors4_1: MCU (U4.86), U_Proximity Sensors4 (R19_U_Proximity_Sensors4.1 R20_U_Proximity_Sensors4.2)
Reset: MCU (U4.30), Reset (C10.2 R6.1 SW1.3 SW1.4), Cording (J10.1)
RPWM: MCU (U4.74), U_Motor Drivers2 (J5_U_Motor_Drivers2.3)
RPWM: MCU (U4.76), U_Motor Drivers1 (J5_U_Motor_Drivers1.3)
TRIG: MCU (U4.96), U_Ultrasonic Sensors1 (J7_U_Ultrasonic_Sensors1.3)
TRIG: MCU (U4.94), U_Ultrasonic Sensors2 (J7_U_Ultrasonic_Sensors2.3)
TRIG: MCU (U4.92), U_Ultrasonic Sensor3 (J7_U_Ultrasonic_Sensor3.3)